# Altium project DuAn_HighVoltage_V3.PrjPcb (part 1 of 2)
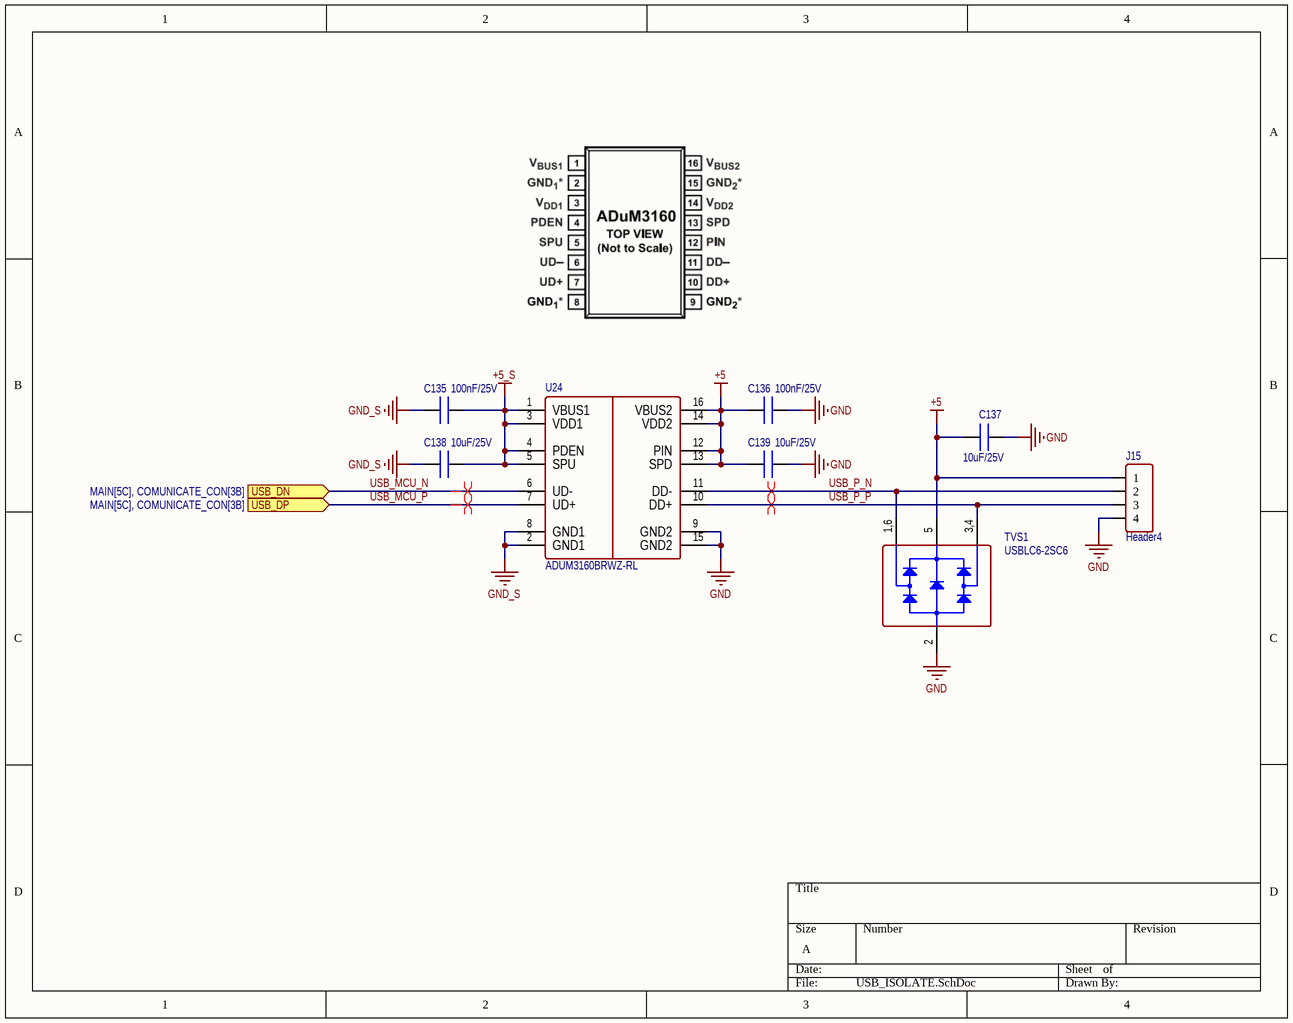
[diagram p0: USB_ISOLATE.SchDoc]
20 sheets, 387 parts. Net scope: hierarchical (ports join the sheet entries above them; power ports are global).
Board file: PCB1.PcbDoc
Sheets:
  USB_ISOLATE.SchDoc
  MAIN.SchDoc
    RS232 = RS232.SchDoc
    EXTERNAL_FAN1 = EXTERNAL_FAN.SchDoc
    EXTERNAL_FAN2 = EXTERNAL_FAN.SchDoc
    FLYBACK_300V = FLYBACK.SchDoc
      TEMPERATURE_SENSOR = TEMPERATURE_SENSOR.SchDoc
    FLYBACK_50V = FLYBACK.SchDoc
      TEMPERATURE_SENSOR = TEMPERATURE_SENSOR.SchDoc
    U_CAPACITOR = CAPACITOR.SchDoc
    INPUT_PROTECTION = INPUT_PROTECTION.SchDoc
    SECONDARY_POWER = SECONDARY_POWER.SchDoc
    PRIMARY_POWER = PRIMARY_POWER.SchDoc
    U_ACCELEROMETER = ACCELEROMETER.SchDoc
    U_ANALOG = ANALOG.SchDoc
    U_OVP = OVP.SchDoc
    U_CAP_RELEASE = CAP_RELEASE.SchDoc
    U_XBEE = XBEE.SchDoc
    U_POWER_CON = POWER_CON.SchDoc
    U_COMUNICATE_CON = COMUNICATE_CON.SchDoc
    U_PERIPHERAL_CON = PERIPHERAL_CON.SchDoc
    U_CHARGER = CHARGER.SchDoc
      U_I2C_ISO = I2C_ISO.SchDoc

## Sheet USB_ISOLATE.SchDoc
size A; SheetNumber: 8; SheetTotal: 21

### Parts
C135  100nF/25V  [CN-SMD-0603]
C136  100nF/25V  [CN-SMD-0603]
C137  10uF/25V  [CN-SMD-0603]
C138  10uF/25V  [CN-SMD-0603]
C139  10uF/25V  [CN-SMD-0603]
J15  Header4  [XH2.54-4-DIP]
TVS1  USBLC6-2SC6  [SOT23-6]
U24  ADUM3160BRWZ-RL  [SO16L]

### Ports
USB_DN (in, see MAIN[5C], COMUNICATE_CON[3B]), USB_DP (in, see MAIN[5C], COMUNICATE_CON[3B])

### Nets
+5: C136.2 C137.2 C139.2 J15.1 TVS1.5 U24.12(PIN) U24.13(SPD) U24.14(VDD2) U24.16(VBUS2)
+5_S: C135.1 C138.1 U24.1(VBUS1) U24.3(VDD1) U24.4(PDEN) U24.5(SPU)
GND: C136.1 C137.1 C139.1 J15.4 TVS1.2 U24.9(GND2) U24.15(GND2)
GND_S: C135.2 C138.2 U24.2(GND1) U24.8(GND1)
USB_MCU_N: U24.6(UD-) ; port USB_DN
USB_MCU_P: U24.7(UD+) ; port USB_DP
USB_P_N: J15.2 TVS1.1,6(IO1) U24.11(DD-)
USB_P_P: J15.3 TVS1.3,4(IO2) U24.10(DD+)

### Layout directives
differential pair; differential pair class USB: USB_P_N, USB_P_P
differential pair: USB_MCU_N, USB_MCU_P

### Library data of the parts
C135 C136 = CN: CL10B104KA8NNNC; PN: CL10B104KA8NNNC
C137-C139 = CN: 0603W106M250XD; PN: 0603W106M250XD
J15 = Header4: Connector 4; Manufacturer: W¨¹rth Elektronik eiSos GmbH; partNo: 613002143121; ComponentLink1 Description: Manufacturer; ComponentLink2 Description: Datasheet; NoPins: 02; Created Date: 29 March 2013; ComponentLink1URL: http://www.we-online.com; ComponentLink2URL: http://katalog.we-online.de/em/datasheet/6130xx143121.pdf; Created by: Karrer Zheng
TVS1 = USBLC6-2: PN: USBLC6-2SC6
U24 = ADUM3160: Full/Low Speed 2.5 kV USB Digital Isolator; PN: ADUM3160BRWZ-RL

## Sheet MAIN.SchDoc
size C; SheetNumber: 2; SheetTotal: 21
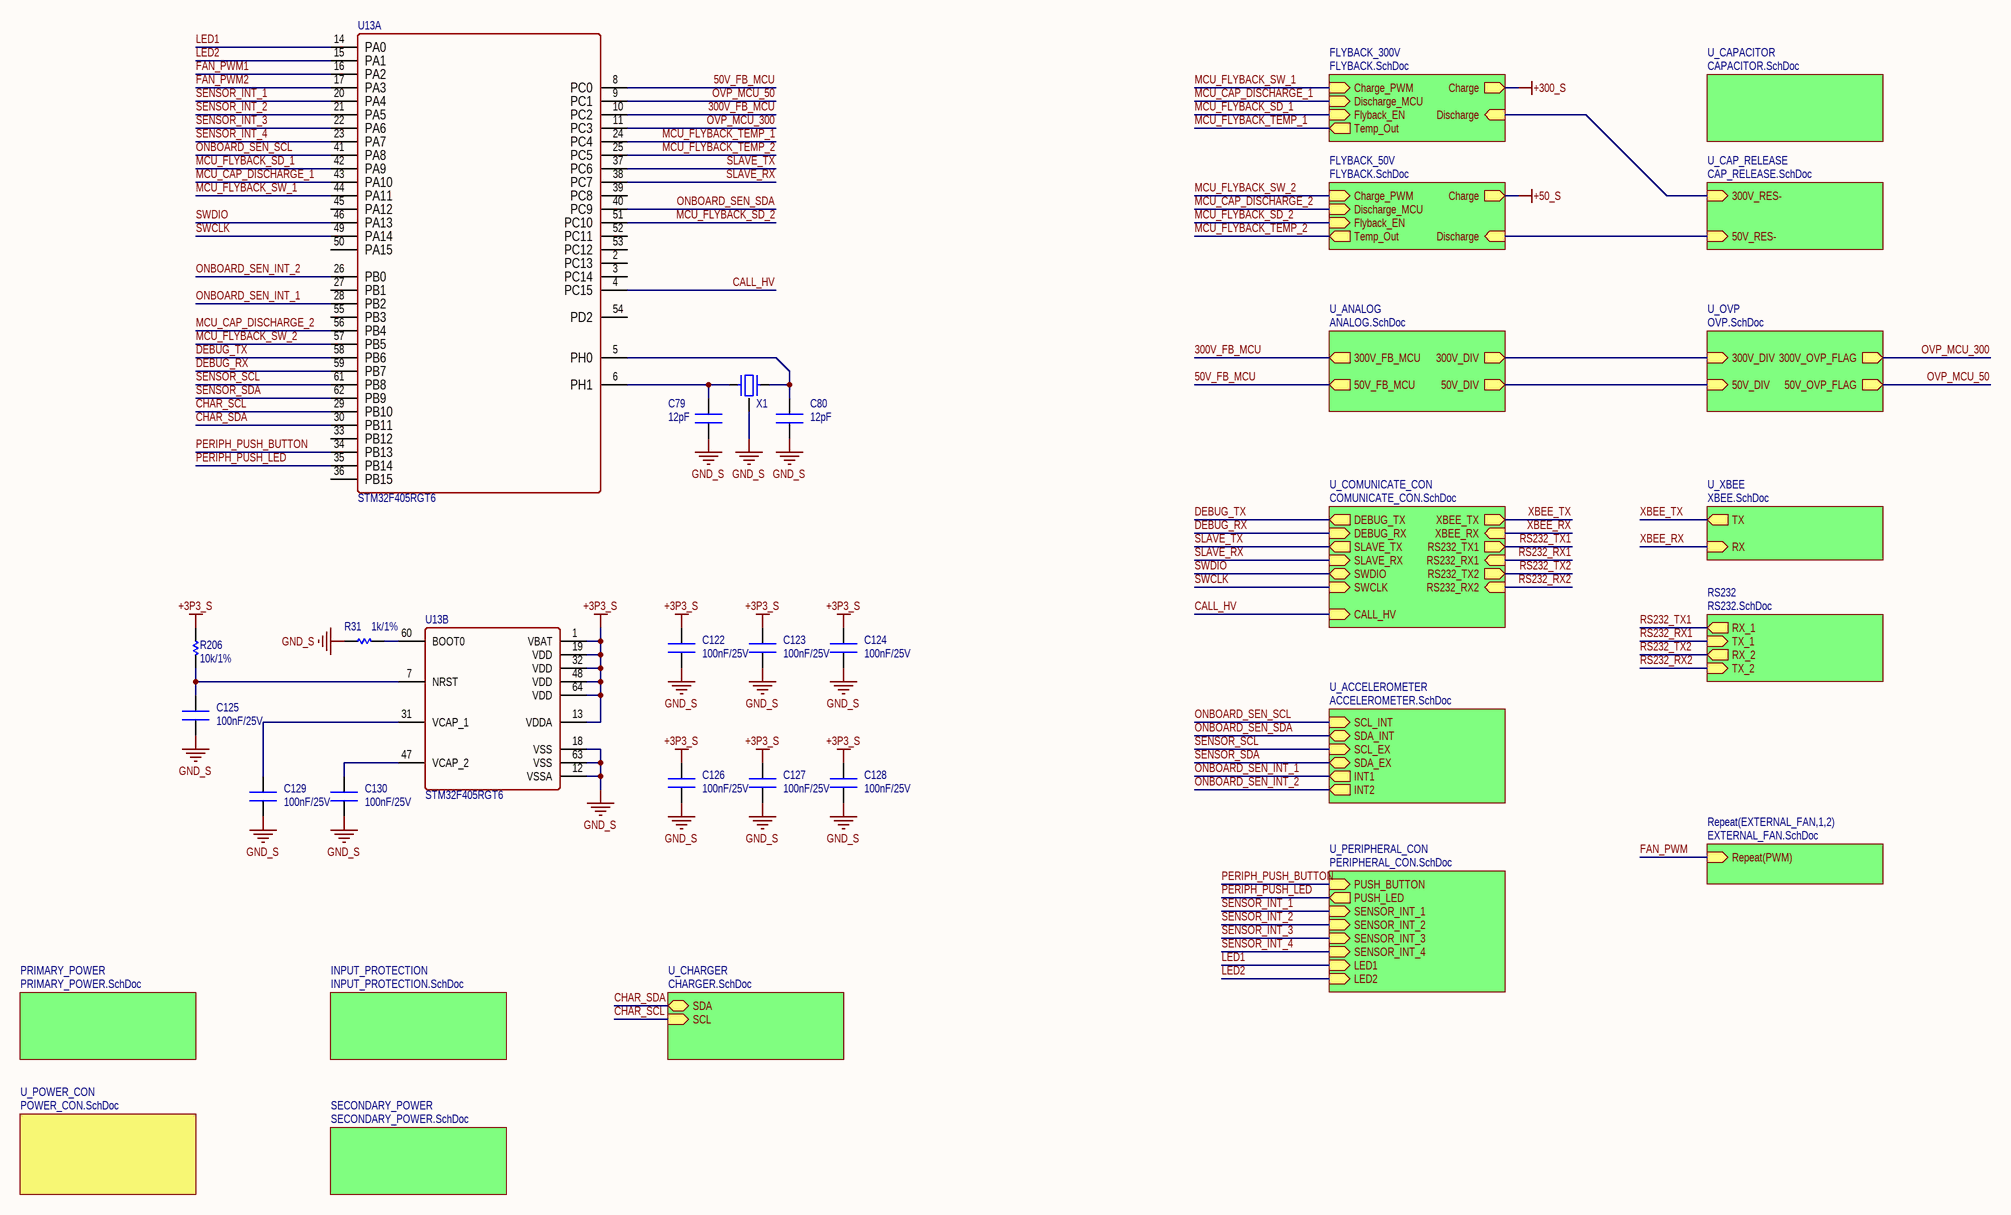
[diagram p1: MAIN.SchDoc]

### Parts
C79  12pF  [CN-SMD-0603]
C80  12pF  [CN-SMD-0603]
C122  100nF/25V  [CN-SMD-0603]
C123  100nF/25V  [CN-SMD-0603]
C124  100nF/25V  [CN-SMD-0603]
C125  100nF/25V  [CN-SMD-0603]
C126  100nF/25V  [CN-SMD-0603]
C127  100nF/25V  [CN-SMD-0603]
C128  100nF/25V  [CN-SMD-0603]
C129  100nF/25V  [CN-SMD-0603]
C130  100nF/25V  [CN-SMD-0603]
R31  1k/1%  [RES-SMD-0603]
R206  10k/1%  [RES-SMD-0603]
U13  STM32F405RGT6  [LQFP64]  (parts A,B of 2)
X1  ECS-80-8-33Q-ADS  [XT4-16.000MHz-4_V]  (value not drawn)

### Sub-sheets
FLYBACK_50V = FLYBACK.SchDoc: Discharge (in), Charge (out), Charge_PWM (in), Discharge_MCU (in), Flyback_EN (in), Temp_Out (out)
FLYBACK_300V = FLYBACK.SchDoc: Discharge (in), Charge (out), Charge_PWM (in), Discharge_MCU (in), Flyback_EN (in), Temp_Out (out)
INPUT_PROTECTION = INPUT_PROTECTION.SchDoc: no entries
PRIMARY_POWER = PRIMARY_POWER.SchDoc: no entries
Repeat(EXTERNAL_FAN,1,2) = EXTERNAL_FAN.SchDoc: Repeat(PWM) (in)
RS232 = RS232.SchDoc: RX_1 (out), TX_1 (in), RX_2 (out), TX_2 (in)
SECONDARY_POWER = SECONDARY_POWER.SchDoc: no entries
U_ACCELEROMETER = ACCELEROMETER.SchDoc: SCL_INT (in), SDA_INT (bidir), INT1 (out), INT2 (out), SCL_EX (in), SDA_EX (bidir)
U_ANALOG = ANALOG.SchDoc: 300V_FB_MCU (out), 50V_FB_MCU (out), 50V_DIV (out), 300V_DIV (out)
U_CAP_RELEASE = CAP_RELEASE.SchDoc: 300V_RES- (in), 50V_RES- (in)
U_CAPACITOR = CAPACITOR.SchDoc: no entries
U_CHARGER = CHARGER.SchDoc: SDA (bidir), SCL (in)
U_COMUNICATE_CON = COMUNICATE_CON.SchDoc: XBEE_TX (out), XBEE_RX (in), RS232_TX1 (out), RS232_RX1 (in), SLAVE_TX (out), SWDIO (bidir), SWCLK (in), DEBUG_TX (out), DEBUG_RX (in), RS232_TX2 (out), RS232_RX2 (in), SLAVE_RX (in), CALL_HV (in)
U_OVP = OVP.SchDoc: 300V_OVP_FLAG (out), 300V_DIV (in), 50V_OVP_FLAG (out), 50V_DIV (in)
U_PERIPHERAL_CON = PERIPHERAL_CON.SchDoc: PUSH_BUTTON (in), PUSH_LED (out), SENSOR_INT_1 (in), SENSOR_INT_2 (in), SENSOR_INT_3 (in), SENSOR_INT_4 (in), LED1 (in), LED2 (in)
U_POWER_CON = POWER_CON.SchDoc: no entries
U_XBEE = XBEE.SchDoc: TX (out), RX (in)

### Nets
+3P3_S: C122.1 C123.1 C124.1 C126.1 C127.1 C128.1 R206.2 U13.1(VBAT) U13.13(VDDA) U13.19(VDD) U13.32(VDD) U13.48(VDD) U13.64(VDD)
GND_S: C79.1 C80.1 C122.2 C123.2 C124.2 C125.2 C126.2 C127.2 C128.2 C129.2 C130.2 R31.2 U13.12(VSSA) U13.18(VSS) U13.63(VSS) X1.2,4(GND)
50V_FB_MCU: U13.8(PC0) ; sheet U_ANALOG/50V_FB_MCU
300V_FB_MCU: U13.10(PC2) ; sheet U_ANALOG/300V_FB_MCU
CALL_HV: U13.4(PC15) ; sheet U_COMUNICATE_CON/CALL_HV
CHAR_SCL: U13.29(PB10) ; sheet U_CHARGER/SCL
CHAR_SDA: U13.30(PB11) ; sheet U_CHARGER/SDA
DEBUG_RX: U13.59(PB7) ; sheet U_COMUNICATE_CON/DEBUG_RX
DEBUG_TX: U13.58(PB6) ; sheet U_COMUNICATE_CON/DEBUG_TX
FAN_PWM: sheet Repeat(EXTERNAL_FAN,1,2)/Repeat(PWM)
FAN_PWM1: U13.16(PA2)
FAN_PWM2: U13.17(PA3)
LED1: U13.14(PA0) ; sheet U_PERIPHERAL_CON/LED1
LED2: U13.15(PA1) ; sheet U_PERIPHERAL_CON/LED2
MCU_CAP_DISCHARGE_1: U13.43(PA10) ; sheet FLYBACK_300V/Discharge_MCU
MCU_CAP_DISCHARGE_2: U13.56(PB4) ; sheet FLYBACK_50V/Discharge_MCU
MCU_FLYBACK_SD_1: U13.42(PA9) ; sheet FLYBACK_300V/Flyback_EN
MCU_FLYBACK_SD_2: U13.51(PC10) ; sheet FLYBACK_50V/Flyback_EN
MCU_FLYBACK_SW_1: U13.44(PA11) ; sheet FLYBACK_300V/Charge_PWM
MCU_FLYBACK_SW_2: U13.57(PB5) ; sheet FLYBACK_50V/Charge_PWM
MCU_FLYBACK_TEMP_1: U13.24(PC4) ; sheet FLYBACK_300V/Temp_Out
MCU_FLYBACK_TEMP_2: U13.25(PC5) ; sheet FLYBACK_50V/Temp_Out
ONBOARD_SEN_INT_1: U13.28(PB2) ; sheet U_ACCELEROMETER/INT1
ONBOARD_SEN_INT_2: U13.26(PB0) ; sheet U_ACCELEROMETER/INT2
ONBOARD_SEN_SCL: U13.41(PA8) ; sheet U_ACCELEROMETER/SCL_INT
ONBOARD_SEN_SDA: U13.40(PC9) ; sheet U_ACCELEROMETER/SDA_INT
OVP_MCU_50: U13.9(PC1) ; sheet U_OVP/50V_OVP_FLAG
OVP_MCU_300: U13.11(PC3) ; sheet U_OVP/300V_OVP_FLAG
PERIPH_PUSH_BUTTON: U13.34(PB13) ; sheet U_PERIPHERAL_CON/PUSH_BUTTON
PERIPH_PUSH_LED: U13.35(PB14) ; sheet U_PERIPHERAL_CON/PUSH_LED
RS232_RX1: sheet RS232/TX_1, sheet U_COMUNICATE_CON/RS232_RX1
RS232_RX2: sheet RS232/TX_2, sheet U_COMUNICATE_CON/RS232_RX2
RS232_TX1: sheet RS232/RX_1, sheet U_COMUNICATE_CON/RS232_TX1
RS232_TX2: sheet RS232/RX_2, sheet U_COMUNICATE_CON/RS232_TX2
SENSOR_INT_1: U13.20(PA4) ; sheet U_PERIPHERAL_CON/SENSOR_INT_1
SENSOR_INT_2: U13.21(PA5) ; sheet U_PERIPHERAL_CON/SENSOR_INT_2
SENSOR_INT_3: U13.22(PA6) ; sheet U_PERIPHERAL_CON/SENSOR_INT_3
SENSOR_INT_4: U13.23(PA7) ; sheet U_PERIPHERAL_CON/SENSOR_INT_4
SENSOR_SCL: U13.61(PB8) ; sheet U_ACCELEROMETER/SCL_EX
SENSOR_SDA: U13.62(PB9) ; sheet U_ACCELEROMETER/SDA_EX
SLAVE_RX: U13.38(PC7) ; sheet U_COMUNICATE_CON/SLAVE_RX
SLAVE_TX: U13.37(PC6) ; sheet U_COMUNICATE_CON/SLAVE_TX
SWCLK: U13.49(PA14) ; sheet U_COMUNICATE_CON/SWCLK
SWDIO: U13.46(PA13) ; sheet U_COMUNICATE_CON/SWDIO
XBEE_RX: sheet U_XBEE/RX, sheet U_COMUNICATE_CON/XBEE_RX
XBEE_TX: sheet U_XBEE/TX, sheet U_COMUNICATE_CON/XBEE_TX
NetC79_2: C79.2 U13.6(PH1) X1.3
NetC80_2: C80.2 U13.5(PH0) X1.1
NetC125_1: C125.1 R206.1 U13.7(NRST)
NetC129_1: C129.1 U13.31(VCAP_1)
NetC130_1: C130.1 U13.47(VCAP_2)
NetQ2A_2: sheet FLYBACK_300V/Discharge, sheet U_CAP_RELEASE/300V_RES-
NetQ2B_2: sheet FLYBACK_50V/Discharge, sheet U_CAP_RELEASE/50V_RES-
NetR31_1: R31.1 U13.60(BOOT0)
NetR53_2: sheet U_ANALOG/300V_DIV, sheet U_OVP/300V_DIV
NetR57_2: sheet U_ANALOG/50V_DIV, sheet U_OVP/50V_DIV

Not connected (* = marked no-connect by the designer): U13 2(PC13) 3(PC14) 27(PB1) 33(PB12) 36(PB15) 39(PC8) 45(PA12) 50(PA15) 52(PC11) 53(PC12) 54(PD2) 55(PB3)

### Library data of the parts
C79 C80 = CN: CL10C120JB81PNC; PN: CL10C120JB81PNC
C122-C130 = CN: CL10B104KA8NNNC; PN: CL10B104KA8NNNC
R31 = Res-SMD: ERJ-3EKF1001V; Manufacturer: Generic Components; Class: Passive; PN: ERJ-3EKF1001V; Publisher: Altium Hobart Technology Centre
R206 = Res-SMD: ERJ-3EKF1002V; Manufacturer: Generic Components; Class: Passive; PN: ERJ-3EKF1002V; Publisher: Altium Hobart Technology Centre
U13 = STM32F405RGT6: High-performance foundation line, ARM Cortex-M4 core with DSP and FPU, 1 Mbyte Flash, 168 MHz CPU, ART Accelerator; PN: STM32F405RGT6
X1 = XT4: PN: ECS-80-8-33Q-ADS

## Sheet RS232.SchDoc
size A; SheetNumber: 10; SheetTotal: 21
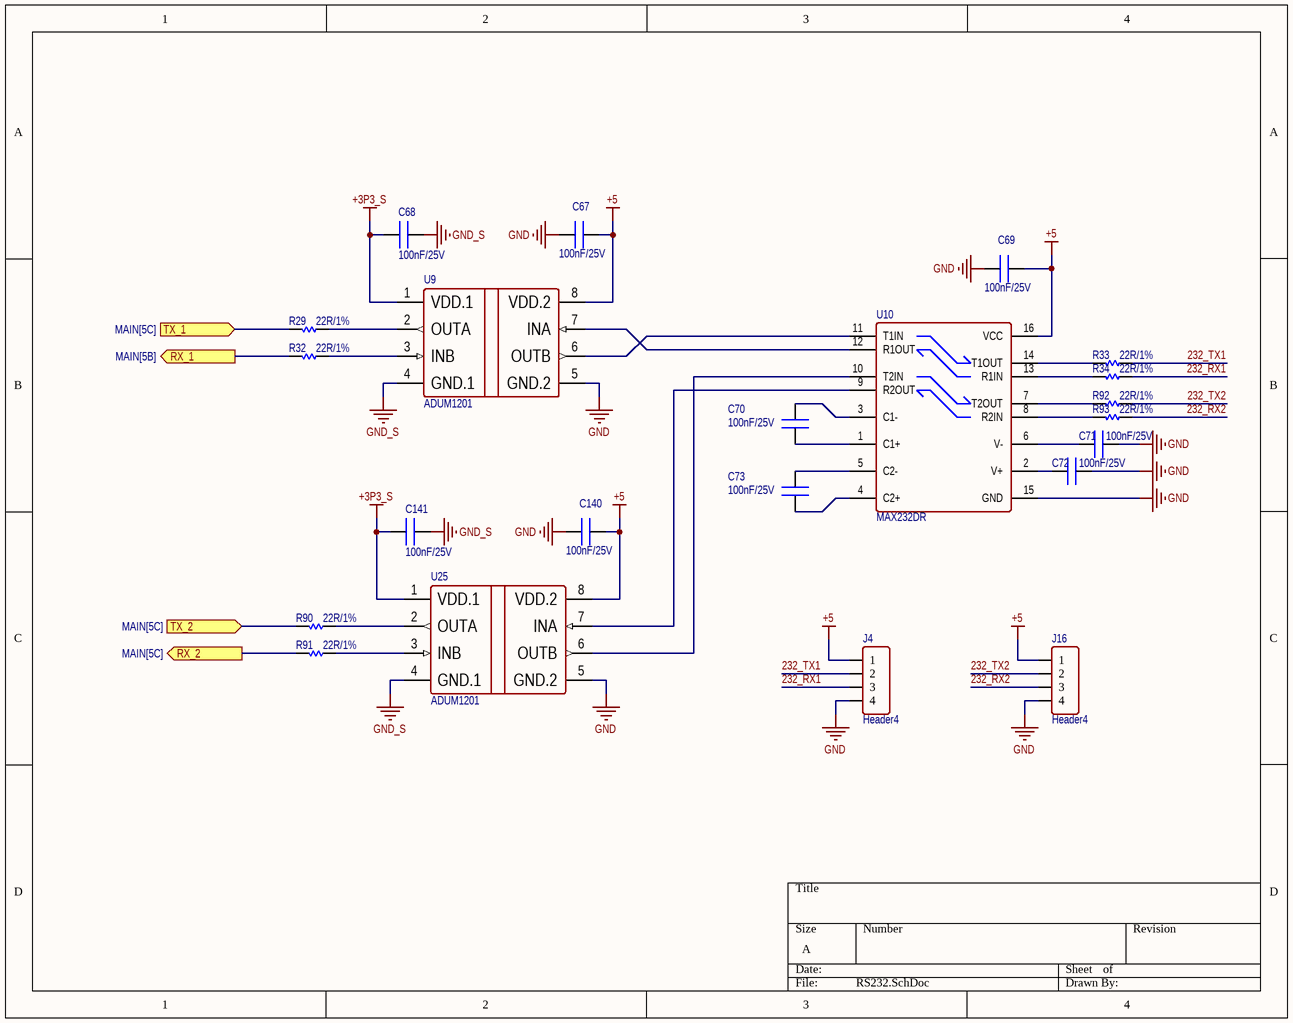
[diagram p2: RS232.SchDoc]

### Parts
C67  100nF/25V  [CN-SMD-0603]
C68  100nF/25V  [CN-SMD-0603]
C69  100nF/25V  [CN-SMD-0603]
C70  100nF/25V  [CN-SMD-0603]
C71  100nF/25V  [CN-SMD-0603]
C72  100nF/25V  [CN-SMD-0603]
C73  100nF/25V  [CN-SMD-0603]
C140  100nF/25V  [CN-SMD-0603]
C141  100nF/25V  [CN-SMD-0603]
J4  Header4  [XH2.54-4-DIP]
J16  Header4  [XH2.54-4-DIP]
R29  22R/1%  [RES-SMD-0603]
R32  22R/1%  [RES-SMD-0603]
R33  22R/1%  [RES-SMD-0603]
R34  22R/1%  [RES-SMD-0603]
R90  22R/1%  [RES-SMD-0603]
R91  22R/1%  [RES-SMD-0603]
R92  22R/1%  [RES-SMD-0603]
R93  22R/1%  [RES-SMD-0603]
U9  ADUM1201  [SO8]
U10  MAX232DR  [SO16]
U25  ADUM1201  [SO8]

### Ports
RX_1 (out, see MAIN[5B]), RX_2 (out, see MAIN[5C]), TX_1 (in, see MAIN[5C]), TX_2 (in, see MAIN[5C])

### Nets
+3P3_S: C68.2 C141.2 U9.1(VDD.1) U25.1(VDD.1)
+5: C67.1 C69.1 C140.1 J4.1 J16.1 U9.8(VDD.2) U10.16(VCC) U25.8(VDD.2)
GND: C67.2 C69.2 C71.1 C72.1 C140.2 J4.4 J16.4 U9.5(GND.2) U10.15(GND) U25.5(GND.2)
GND_S: C68.1 C141.1 U9.4(GND.1) U25.4(GND.1)
232_RX1: J4.3 R34.1
232_RX2: J16.3 R93.1
232_TX1: J4.2 R33.1
232_TX2: J16.2 R92.1
RS232_RX1: R29.2 ; port TX_1
RS232_RX2: R90.2 ; port TX_2
RS232_TX1: R32.2 ; port RX_1
RS232_TX2: R91.2 ; port RX_2
NetC70_1: C70.1 U10.1(C1+)
NetC70_2: C70.2 U10.3(C1-)
NetC71_2: C71.2 U10.6(V-)
NetC72_2: C72.2 U10.2(V+)
NetC73_1: C73.1 U10.4(C2+)
NetC73_2: C73.2 U10.5(C2-)
NetR29_1: R29.1 U9.2(OUTA)
NetR32_1: R32.1 U9.3(INB)
NetR33_2: R33.2 U10.14(T1OUT)
NetR34_2: R34.2 U10.13(R1IN)
NetR90_1: R90.1 U25.2(OUTA)
NetR91_1: R91.1 U25.3(INB)
NetR92_2: R92.2 U10.7(T2OUT)
NetR93_2: R93.2 U10.8(R2IN)
NetU9_6: U9.6(OUTB) U10.11(T1IN)
NetU9_7: U9.7(INA) U10.12(R1OUT)
NetU10_9: U10.9(R2OUT) U25.7(INA)
NetU10_10: U10.10(T2IN) U25.6(OUTB)

### Library data of the parts
C67-C73 C140 C141 = CN: CL10B104KA8NNNC; PN: CL10B104KA8NNNC
J4 J16 = Header4: as J15 on sheet USB_ISOLATE; Created Date: 29 March 2013; ComponentLink1URL: http://www.we-online.com; ComponentLink2URL: http://katalog.we-online.de/em/datasheet/6130xx143121.pdf; Created by: Karrer Zheng
R29 R32-R34 R90-R93 = Res-SMD: ERJ-3EKF22R0V; PN: ERJ-3EKF22R0V
U9 U25 = ADUM1201: Dual-Channel Digital Isolators; PN: ADUM1201CRZ-RL7
U10 = MAX3232: PN: MAX232DR

## Sheet EXTERNAL_FAN.SchDoc
size A; SheetNumber: 9; SheetTotal: 21
Used 2 times, as channels EXTERNAL_FAN1, EXTERNAL_FAN2. Parts and nets are listed once, with the designators drawn on the sheet.
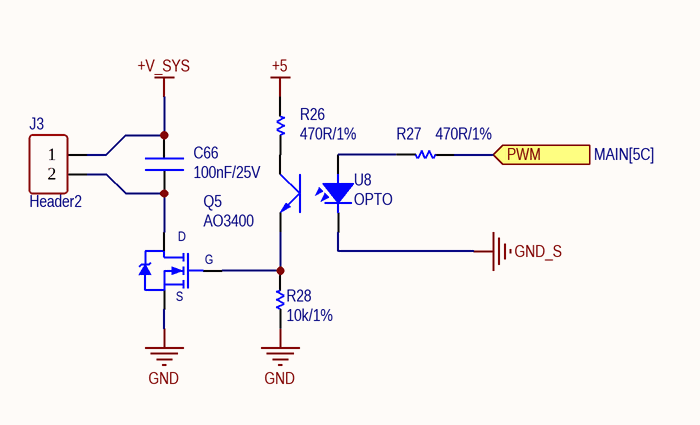
[diagram p3: EXTERNAL_FAN.SchDoc]

### Parts
C66  100nF/25V  [CN-SMD-0603]
J3  Header2  [XH2.54-2-DIP]
Q5  AO3400  [SOT23-123]
R26  470R/1%  [RES-SMD-0603]
R27  470R/1%  [RES-SMD-0603]
R28  10k/1%  [RES-SMD-0603]
U8  OPTO  [EL3H7]

### Ports
PWM (in, see MAIN[5C])

### Nets
+5: R26.1
+V_SYS: C66.1 J3.1
GND: Q5.3(S) R28.1
GND_S: U8.K
PWM: R27.1 ; port PWM
NetC66_2: C66.2 J3.2 Q5.2(D)
NetQ5_1: Q5.1(G) R28.2 U8.E
NetR26_2: R26.2 U8.C
NetR27_2: R27.2 U8.A

### Channels
EXTERNAL_FAN1: designators end in A; ports PWM=FAN_PWM1
EXTERNAL_FAN2: designators end in B; ports PWM=FAN_PWM2

### Library data of the parts
C66 = CN: CL10B104KA8NNNC; PN: CL10B104KA8NNNC
J3 = Header2: Connector 2; Manufacturer: W¨¹rth Elektronik eiSos GmbH; partNo: 613002143121; ComponentLink1 Description: Manufacturer; ComponentLink2 Description: Datasheet; NoPins: 02; Created Date: 29 March 2013; ComponentLink1URL: http://www.we-online.com; ComponentLink2URL: http://katalog.we-online.de/em/datasheet/6130xx143121.pdf; Created by: Karrer Zheng
Q5 = AO3400: N-MOS 30V 5.8A; PN: AO3400
R26 R27 = Res-SMD: ERJ-1GJF4700C; Manufacturer: Generic Components; Class: Passive; PN: ERJ-1GJF4700C; Publisher: Altium Hobart Technology Centre
R28 = Res-SMD: as R206 on sheet MAIN; PN: ERJ-3EKF1002V; Publisher: Altium Hobart Technology Centre
U8 = OPTO: EL3H7(B)(TA)-VG; PN: EL3H7(B)(TA)-VG

## Sheet FLYBACK.SchDoc
size A; SheetNumber: 2; SheetTotal: 21
Used 2 times, as channels FLYBACK_300V, FLYBACK_50V. Parts and nets are listed once, with the designators drawn on the sheet.
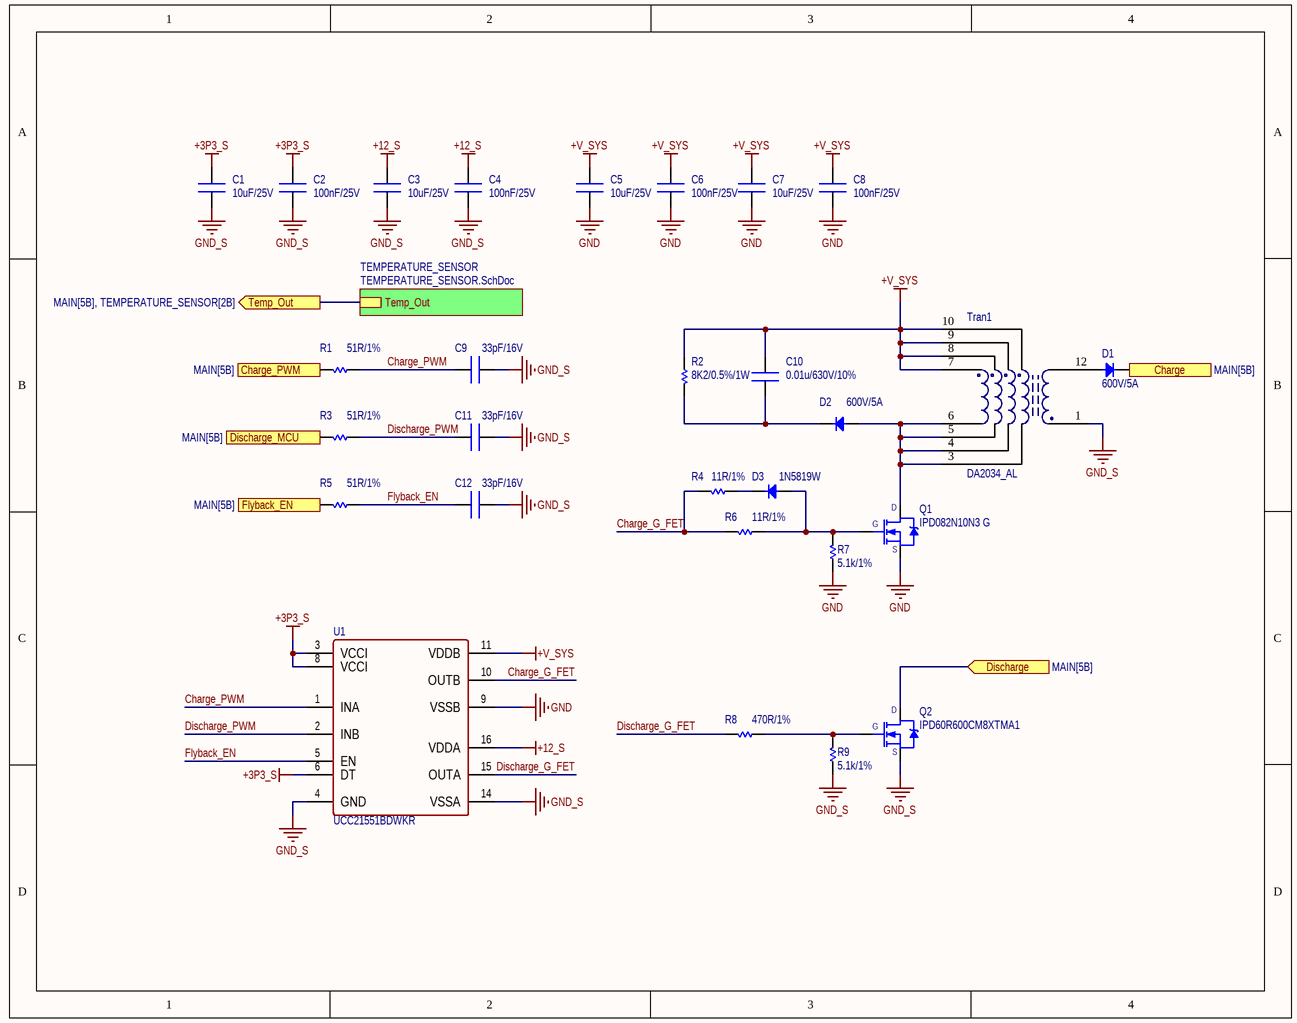
[diagram p4: FLYBACK.SchDoc]

### Parts
C1  10uF/25V  [CN-SMD-0603]
C2  100nF/25V  [CN-SMD-0603]
C3  10uF/25V  [CN-SMD-0603]
C4  100nF/25V  [CN-SMD-0603]
C5  10uF/25V  [CN-SMD-0603]
C6  100nF/25V  [CN-SMD-0603]
C7  10uF/25V  [CN-SMD-0603]
C8  100nF/25V  [CN-SMD-0603]
C9  33pF/16V  [CN-SMD-0603]
C10  0.01u/630V/10%  [CN-SMD-1206]
C11  33pF/16V  [CN-SMD-0603]
C12  33pF/16V  [CN-SMD-0603]
D1  600V/5A  [DIO-SMD-C]
D2  600V/5A  [DIO-SMD-C]
D3  1N5819W  [DIO-SMD-123]
Q1  IPD082N10N3 G  [TO252-123]
Q2  IPD60R600CM8XTMA1  [TO252-123]
R1  51R/1%  [RES-SMD-0603]
R2  8K2/0.5%/1W  [RES-SMD-1206]
R3  51R/1%  [RES-SMD-0603]
R4  11R/1%  [RES-SMD-1206]
R5  51R/1%  [RES-SMD-0603]
R6  11R/1%  [RES-SMD-1206]
R7  5.1k/1%  [RES-SMD-0603]
R8  470R/1%  [RES-SMD-0603]
R9  5.1k/1%  [RES-SMD-0603]
Tran1  DA2034_AL  [DA2034_AL]
U1  UCC21551BDWKR  [UCC21551BDWKR]

### Sub-sheets
TEMPERATURE_SENSOR = TEMPERATURE_SENSOR.SchDoc: Temp_Out

### Ports
Charge (out, see MAIN[5B]), Charge_PWM (in, see MAIN[5B]), Discharge (in, see MAIN[5B]), Discharge_MCU (in, see MAIN[5B]), Flyback_EN (in, see MAIN[5B]), Temp_Out (out, see MAIN[5B], TEMPERATURE_SENSOR[2B])

### Nets
+3P3_S: C1.2 C2.2 U1.3(VCCI) U1.6(DT) U1.8(VCCI)
+12_S: C3.2 C4.2 U1.16(VDDA)
+V_SYS: C5.2 C6.2 C7.2 C8.2 C10.2 R2.1 Tran1.7 Tran1.8 Tran1.9 Tran1.10 U1.11(VDDB)
GND: C5.1 C6.1 C7.1 C8.1 Q1.3(S) R7.1 U1.9(VSSB)
GND_S: C1.1 C2.1 C3.1 C4.1 C9.1 C11.1 C12.1 Q2.3(S) R9.1 Tran1.1 U1.4(GND) U1.14(VSSA)
Charge: D1.2(K) ; port Charge
Charge_G_FET: R4.2 R6.2 U1.10(OUTB)
Charge_PWM: C9.2 R1.1 U1.1(INA)
Charge_PWM: R1.2 ; port Charge_PWM  [a separate net that carries the same name]
Discharge: Q2.2(D) ; port Discharge
Discharge_G_FET: R8.2 U1.15(OUTA)
Discharge_MCU: R3.2 ; port Discharge_MCU
Discharge_PWM: C11.2 R3.1 U1.2(INB)
Flyback_EN: C12.2 R5.1 U1.5(EN)
Flyback_EN: R5.2 ; port Flyback_EN  [a separate net that carries the same name]
Temp_Out: port Temp_Out, sheet TEMPERATURE_SENSOR/Temp_Out
NetC10_1: C10.1 D2.2(K) R2.2
NetD1_1: D1.1(A) Tran1.12
NetD2_1: D2.1(A) Q1.2(D) Tran1.3 Tran1.4 Tran1.5 Tran1.6
NetD3_1: D3.1(A) Q1.1(G) R6.1 R7.2
NetD3_2: D3.2(K) R4.1
NetQ2_1: Q2.1(G) R8.1 R9.2

### Channels
FLYBACK_300V: designators end in A; ports Charge=+300_S Charge_PWM=MCU_FLYBACK_SW_1 Discharge=NetQ2A_2 Discharge_MCU=MCU_CAP_DISCHARGE_1 Flyback_EN=MCU_FLYBACK_SD_1 Temp_Out=MCU_FLYBACK_TEMP_1
FLYBACK_50V: designators end in B; ports Charge=+50_S Charge_PWM=MCU_FLYBACK_SW_2 Discharge=NetQ2B_2 Discharge_MCU=MCU_CAP_DISCHARGE_2 Flyback_EN=MCU_FLYBACK_SD_2 Temp_Out=MCU_FLYBACK_TEMP_2

### Library data of the parts
C1 C3 C5 C7 = CN: 0603W106M250XD; PN: 0603W106M250XD
C2 C4 C6 C8 = CN: CL10B104KA8NNNC; PN: CL10B104KA8NNNC
C9 C11 C12 = CN: C0603C330K4RAC7867; PN: C0603C330K4RAC7867
C10 = CN: CL31B103KHFNFNE; Value: 33pF; PN: CL31B103KHFNFNE
D1 D2 = Diode SMD: VS-5ECU06-M3/9AT; Code - JEDEC: DO-214-AB; Published: 8-Jun-2000; Revision: July-2002: Re-released for DXP Platform.; Publisher: Altium Limited; PN: VS-5ECU06-M3/9AT
D3 = Diode SMD: Default Diode; Code - JEDEC: DO-214-AB; Published: 8-Jun-2000; Revision: July-2002: Re-released for DXP Platform.; Publisher: Altium Limited; PN: 1N5819W
Q1 Q2 = FDD8870
  Q1: PN: IPD082N10N3 G
  Q2: PN: IPD60R600CM8XTMA1
R1 R3 R5 = Res-SMD: ERJ-3EKF51R0V; Manufacturer: Generic Components; Class: Passive; PN: ERJ-3EKF51R0V; Publisher: Altium Hobart Technology Centre
R2 = Res-SMD: HRG3216P-8201-D-T1; Manufacturer: Generic Components; Class: Passive; PN: HRG3216P-8201-D-T1; Publisher: Altium Hobart Technology Centre
R4 R6 = Res-SMD: CRCW120611R0FKEAHP; Manufacturer: Generic Components; Class: Passive; PN: CRCW120611R0FKEAHP; Publisher: Altium Hobart Technology Centre
R7 R9 = Res-SMD: ERJ-3EKF5101V; PN: ERJ-3EKF5101V
R8 = Res-SMD: as R26 on sheet EXTERNAL_FAN; PN: ERJ-1GJF4700C; Publisher: Altium Hobart Technology Centre
Tran1 = DA2034_AL: PN: DA2034_AL
U1 = UCC21551BDWKR: PN: UCC21551BDWKR

## Sheet TEMPERATURE_SENSOR.SchDoc
size A; SheetNumber: 3; SheetTotal: 21
Used 2 times, as channels FLYBACK_300V/TEMPERATURE_SENSOR, FLYBACK_50V/TEMPERATURE_SENSOR. Parts and nets are listed once, with the designators drawn on the sheet.
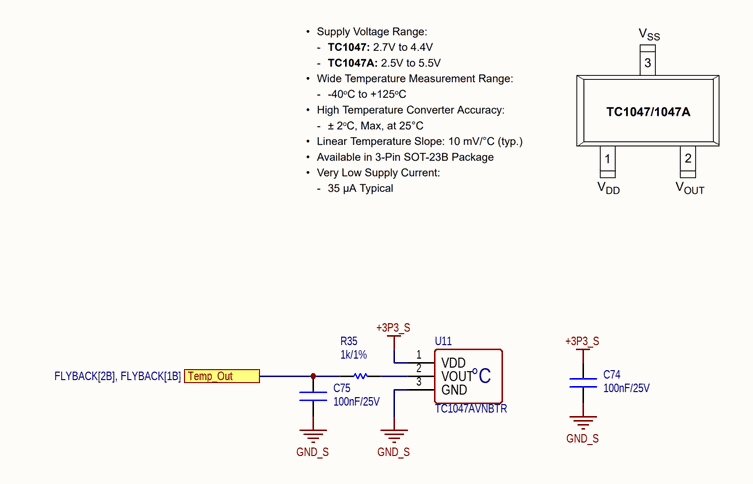
[diagram p5: TEMPERATURE_SENSOR.SchDoc]

### Parts
C74  100nF/25V  [CN-SMD-0603]
C75  100nF/25V  [CN-SMD-0603]
R35  1k/1%  [RES-SMD-0603]
U11  TC1047AVNBTR  [SOT23-132]

### Ports
Temp_Out (see FLYBACK[2B], FLYBACK[1B])

### Nets
+3P3_S: C74.2 U11.1(VDD)
GND_S: C74.1 C75.1 U11.3(GND)
Temp_Out: C75.2 R35.1 ; port Temp_Out
NetR35_2: R35.2 U11.2(VOUT)

### Channels
FLYBACK_300V/TEMPERATURE_SENSOR: designators end in A; ports Temp_Out=MCU_FLYBACK_TEMP_1
FLYBACK_50V/TEMPERATURE_SENSOR: designators end in B; ports Temp_Out=MCU_FLYBACK_TEMP_2

### Notes on the sheet
- (in symbol TC1047AVNBTR) °C

### Library data of the parts
C74 C75 = CN: CL10B104KA8NNNC; PN: CL10B104KA8NNNC
R35 = Res-SMD: as R31 on sheet MAIN; PN: ERJ-3EKF1001V; Publisher: Altium Hobart Technology Centre
U11 = TC1047AVNBTR: Precision Temperature-to-Voltage Converter; PN: TC1047AVNBTR

## Sheet CAPACITOR.SchDoc
size A; SheetNumber: 4; SheetTotal: 21
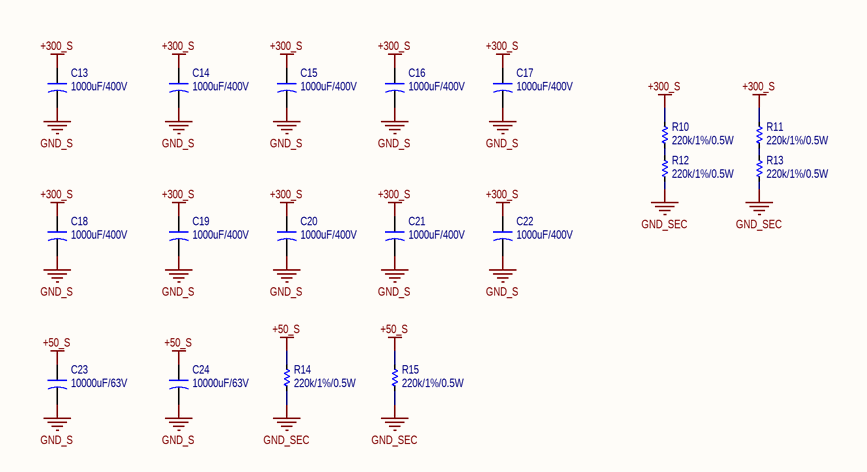
[diagram p6: CAPACITOR.SchDoc]

### Parts
C13  1000uF/400V  [CA-ALU-35x50]
C14  1000uF/400V  [CA-ALU-35x50]
C15  1000uF/400V  [CA-ALU-35x50]
C16  1000uF/400V  [CA-ALU-35x50]
C17  1000uF/400V  [CA-ALU-35x50]
C18  1000uF/400V  [CA-ALU-35x50]
C19  1000uF/400V  [CA-ALU-35x50]
C20  1000uF/400V  [CA-ALU-35x50]
C21  1000uF/400V  [CA-ALU-35x50]
C22  1000uF/400V  [CA-ALU-35x50]
C23  10000uF/63V  [CA-ALU-35x50]
C24  10000uF/63V  [CA-ALU-35x50]
R10  220k/1%/0.5W  [RES-SMD-2010]
R11  220k/1%/0.5W  [RES-SMD-2010]
R12  220k/1%/0.5W  [RES-SMD-2010]
R13  220k/1%/0.5W  [RES-SMD-2010]
R14  220k/1%/0.5W  [RES-SMD-2010]
R15  220k/1%/0.5W  [RES-SMD-2010]

### Nets
+50_S: C23.1 C24.1 R14.1 R15.1
+300_S: C13.1 C14.1 C15.1 C16.1 C17.1 C18.1 C19.1 C20.1 C21.1 C22.1 R10.1 R11.1
GND_S: C13.2 C14.2 C15.2 C16.2 C17.2 C18.2 C19.2 C20.2 C21.2 C22.2 C23.2 C24.2
GND_SEC: R12.2 R13.2 R14.2 R15.2
NetR10_2: R10.2 R12.1
NetR11_2: R11.2 R13.1

### Library data of the parts
C13-C24 = CN-ALU-DIP: NO PN; Value: 104; LatestRevisionDate: 17-Jul-2002; LatestRevisionNote: Re-released for DXP Platform.; PackageReference: C1206; Publisher: Altium Limited
R10-R15 = Res-SMD: CHV2010-FX-2203ELF; Manufacturer: Generic Components; Class: Passive; PN: CHV2010-FX-2203ELF; Publisher: Altium Hobart Technology Centre

## Sheet INPUT_PROTECTION.SchDoc
size A; SheetNumber: 5; SheetTotal: 21
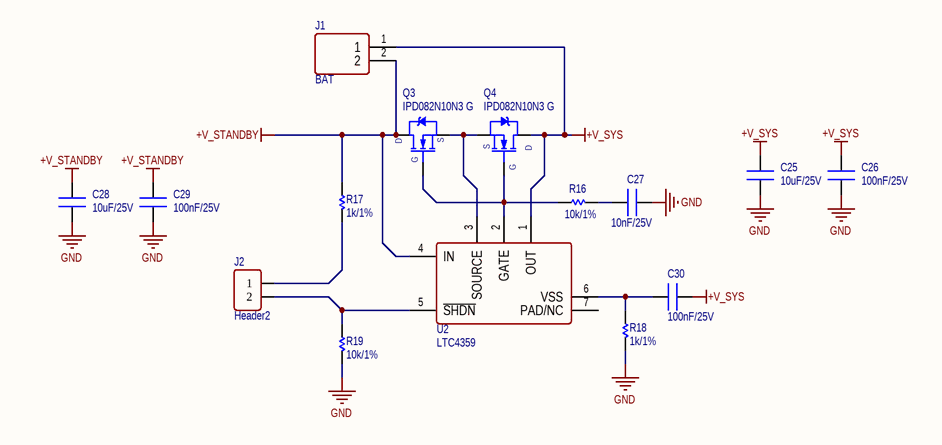
[diagram p7: INPUT_PROTECTION.SchDoc]

### Parts
C25  10uF/25V  [CN-SMD-0603]
C26  100nF/25V  [CN-SMD-0603]
C27  10nF/25V  [CN-SMD-0603]
C28  10uF/25V  [CN-SMD-0603]
C29  100nF/25V  [CN-SMD-0603]
C30  100nF/25V  [CN-SMD-0603]
J1  BAT  [S2P-VH(LF)(SN)]
J2  Header2  [XH2.54-2-DIP]
Q3  IPD082N10N3 G  [TO252-123]
Q4  IPD082N10N3 G  [TO252-123]
R16  10k/1%  [RES-SMD-0603]
R17  1k/1%  [RES-SMD-0603]
R18  1k/1%  [RES-SMD-0603]
R19  10k/1%  [RES-SMD-0603]
U2  LTC4359  [VSSOP8]

### Nets
+V_STANDBY: C28.2 C29.2 J1.2 Q3.2(D) R17.1 U2.4(IN)
+V_SYS: C25.2 C26.2 C30.2 J1.1 Q4.2(D) U2.1(OUT)
GND: C25.1 C26.1 C27.1 C28.1 C29.1 R18.2 R19.2
NetC27_2: C27.2 R16.2
NetC30_1: C30.1 R18.1 U2.6(VSS)
NetJ2_1: J2.1 R17.2
NetJ2_2: J2.2 R19.1 U2.5(~{SHDN})
NetQ3_1: Q3.1(G) Q4.1(G) R16.1 U2.2(GATE)
NetQ3_3: Q3.3(S) Q4.3(S) U2.3(SOURCE)

Not connected (* = marked no-connect by the designer): U2 7(PAD/NC)

### Library data of the parts
C25 C28 = CN: 0603W106M250XD; PN: 0603W106M250XD
C26 C29 C30 = CN: CL10B104KA8NNNC; PN: CL10B104KA8NNNC
C27 = CN: CL10B103KB8NNNC; PN: CL10B103KB8NNNC
J1 = KF2: S2P-VH; ComponentLink1 Description: Manufacturer; ComponentLink2 Description: Datasheet; PN: S2P-VH; ComponentLink1URL: http://www.we-online.com; ComponentLink2URL: http://katalog.we-online.de/em/datasheet/6911031100xx.pdf
J2 = Header2: as J3 on sheet EXTERNAL_FAN; Created Date: 29 March 2013; ComponentLink1URL: http://www.we-online.com; ComponentLink2URL: http://katalog.we-online.de/em/datasheet/6130xx143121.pdf; Created by: Karrer Zheng
Q3 Q4 = FDD8870: PN: IPD082N10N3 G
R16 R19 = Res-SMD: as R206 on sheet MAIN; PN: ERJ-3EKF1002V; Publisher: Altium Hobart Technology Centre
R17 R18 = Res-SMD: as R31 on sheet MAIN; PN: ERJ-3EKF1001V; Publisher: Altium Hobart Technology Centre
U2 = LTC4359: Ideal Diode Controller with Reverse Input Protection; pin to pad: 1>8 2>1 3>2; PN: LTC4359CMS8#TRPBF

## Sheet SECONDARY_POWER.SchDoc
size A; SheetNumber: 7; SheetTotal: 21
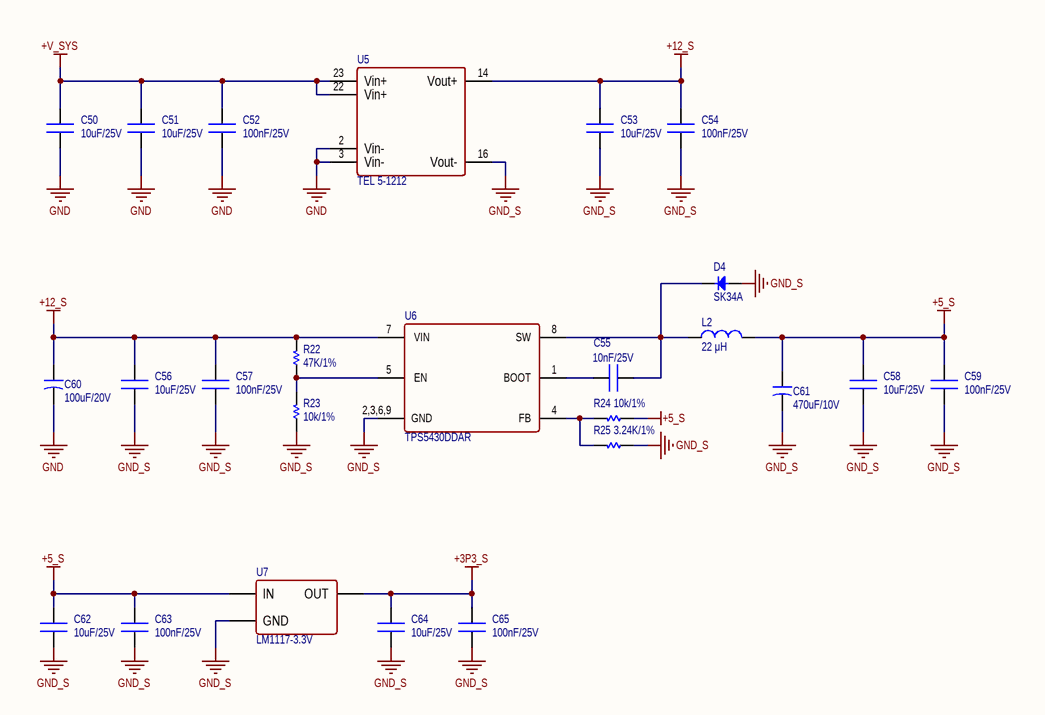
[diagram p8: SECONDARY_POWER.SchDoc]

### Parts
C50  10uF/25V  [CN-SMD-0603]
C51  10uF/25V  [CN-SMD-0603]
C52  100nF/25V  [CN-SMD-0603]
C53  10uF/25V  [CN-SMD-0603]
C54  100nF/25V  [CN-SMD-0603]
C55  10nF/25V  [CN-SMD-0603]
C56  10uF/25V  [CN-SMD-0603]
C57  100nF/25V  [CN-SMD-0603]
C58  10uF/25V  [CN-SMD-0603]
C59  100nF/25V  [CN-SMD-0603]
C60  100uF/20V  [Tantalum 2917]
C61  470uF/10V  [Tantalum 2917]
C62  10uF/25V  [CN-SMD-0603]
C63  100nF/25V  [CN-SMD-0603]
C64  10uF/25V  [CN-SMD-0603]
C65  100nF/25V  [CN-SMD-0603]
D4  SK34A  [DIO-SMD-A]
L2  22 μH  [PSM6050]
R22  47K/1%  [RES-SMD-0603]
R23  10k/1%  [RES-SMD-0603]
R24  10k/1%  [RES-SMD-0603]
R25  3.24K/1%  [RES-SMD-0603]
U5  TEL 5-1212  [TEL_5-XXYY_SINGLE]
U6  TPS5430DDAR  [HSOP8]
U7  LM1117-3.3V  [SOT223]

### Nets
+3P3_S: C64.2 C65.2 U7.2,4(OUT)
+5_S: C58.2 C59.2 C61.1 C62.2 C63.2 L2.2 R24.1 U7.3(IN)
+12_S: C53.2 C54.2 C56.2 C57.2 C60.1 R22.2 U5.14(Vout+) U6.7(VIN)
+V_SYS: C50.2 C51.2 C52.2 U5.22(Vin+) U5.23(Vin+)
GND: C50.1 C51.1 C52.1 C60.2 U5.2(Vin-) U5.3(Vin-)
GND_S: C53.1 C54.1 C56.1 C57.1 C58.1 C59.1 C61.2 C62.1 C63.1 C64.1 C65.1 D4.1(A) R23.1 R25.1 U5.16(Vout-) U6.2,3,6,9(GND) U7.1(GND)
NetC55_1: C55.1 D4.2(K) L2.1 U6.8(SW)
NetC55_2: C55.2 U6.1(BOOT)
NetR22_1: R22.1 R23.2 U6.5(EN)
NetR24_2: R24.2 R25.2 U6.4(FB)

### Library data of the parts
C50 C51 C53 C56 C58 C62 C64 = CN: 0603W106M250XD; PN: 0603W106M250XD
C52 C54 C57 C59 C63 C65 = CN: CL10B104KA8NNNC; PN: CL10B104KA8NNNC
C55 = CN: CL10B103KB8NNNC; PN: CL10B103KB8NNNC
C60 = CN-SMD: TAJD107K020RNJ; PN: TAJD107K020RNJ; LatestRevisionDate: 17-Jul-2002; LatestRevisionNote: Re-released for DXP Platform.; PackageReference: POLAR0.8; Publisher: Altium Limited
C61 = CN-SMD: TAJE477K010RNJ; PN: TAJE477K010RNJ; LatestRevisionDate: 17-Jul-2002; LatestRevisionNote: Re-released for DXP Platform.; PackageReference: POLAR0.8; Publisher: Altium Limited
D4 = Diode SMD: Code - JEDEC: DO-214-AB; Published: 8-Jun-2000; Revision: July-2002: Re-released for DXP Platform.; Publisher: Altium Limited; PN: SK34A
L2 = L-SMD-1: FIXED IND 22UH 2.5A 170 MOHM SMD, P/N: SRP7050TA-220M; Manufacturer: Wurth Elektronik; PN: SRP7050TA-220M; Inductance: 22 μH; ComponentLink1Description: Manufacturer; ComponentLink1URL: http://www.we-online.de; Created by: Baojun Chen; Created Date: Nov.2015; ComponentLink2Description: Datasheet; ComponentLink2URL: http://katalog.we-online.de/pbs/datasheet/78477010.pdf
R22 = Res-SMD: ERJ-3EKF4702V; Manufacturer: Generic Components; Class: Passive; PN: ERJ-3EKF4702V; Publisher: Altium Hobart Technology Centre
R23 R24 = Res-SMD: as R206 on sheet MAIN; PN: ERJ-3EKF1002V; Publisher: Altium Hobart Technology Centre
R25 = Res-SMD: ERJ-3EKF3241V; Manufacturer: Generic Components; Class: Passive; PN: ERJ-3EKF3241V; Publisher: Altium Hobart Technology Centre
U5 = TEL 5-1212: DC DC CONVERTER 12V 6W; PN: TEL 5-1212
U6 = TPS5430: IC REG BUCK ADJ 3A 8SOPWR, P/N: TPS5430DDAR; PN: TPS5430DDAR
U7 = LM1117: TLV1117-33IDCYR; PN: TLV1117-33IDCYR; Website: http://group3i.net

## Sheet PRIMARY_POWER.SchDoc
size A; SheetNumber: 6; SheetTotal: 21
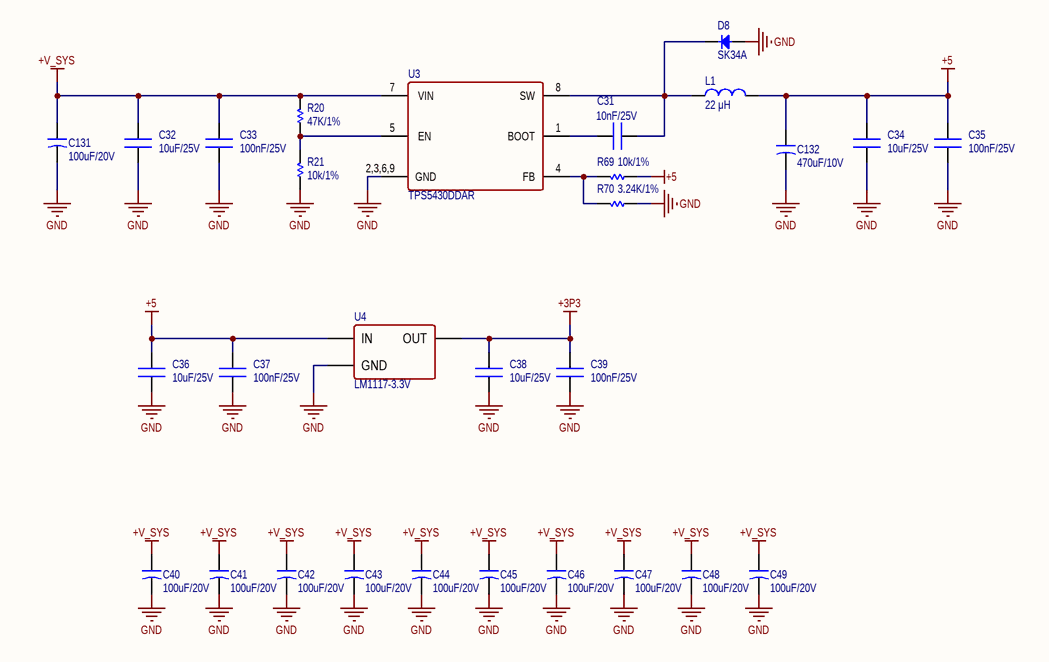
[diagram p9: PRIMARY_POWER.SchDoc]

### Parts
C31  10nF/25V  [CN-SMD-0603]
C32  10uF/25V  [CN-SMD-0603]
C33  100nF/25V  [CN-SMD-0603]
C34  10uF/25V  [CN-SMD-0603]
C35  100nF/25V  [CN-SMD-0603]
C36  10uF/25V  [CN-SMD-0603]
C37  100nF/25V  [CN-SMD-0603]
C38  10uF/25V  [CN-SMD-0603]
C39  100nF/25V  [CN-SMD-0603]
C40  100uF/20V  [Tantalum 2917]
C41  100uF/20V  [Tantalum 2917]
C42  100uF/20V  [Tantalum 2917]
C43  100uF/20V  [Tantalum 2917]
C44  100uF/20V  [Tantalum 2917]
C45  100uF/20V  [Tantalum 2917]
C46  100uF/20V  [Tantalum 2917]
C47  100uF/20V  [Tantalum 2917]
C48  100uF/20V  [Tantalum 2917]
C49  100uF/20V  [Tantalum 2917]
C131  100uF/20V  [Tantalum 2917]
C132  470uF/10V  [Tantalum 2917]
D8  SK34A  [DIO-SMD-A]
L1  22 μH  [PSM6050]
R20  47K/1%  [RES-SMD-0603]
R21  10k/1%  [RES-SMD-0603]
R69  10k/1%  [RES-SMD-0603]
R70  3.24K/1%  [RES-SMD-0603]
U3  TPS5430DDAR  [HSOP8]
U4  LM1117-3.3V  [SOT223]

### Nets
+3P3: C38.2 C39.2 U4.2,4(OUT)
+5: C34.2 C35.2 C36.2 C37.2 C132.1 L1.2 R69.1 U4.3(IN)
+V_SYS: C32.2 C33.2 C40.1 C41.1 C42.1 C43.1 C44.1 C45.1 C46.1 C47.1 C48.1 C49.1 C131.1 R20.2 U3.7(VIN)
GND: C32.1 C33.1 C34.1 C35.1 C36.1 C37.1 C38.1 C39.1 C40.2 C41.2 C42.2 C43.2 C44.2 C45.2 C46.2 C47.2 C48.2 C49.2 C131.2 C132.2 D8.1(A) R21.1 R70.1 U3.2,3,6,9(GND) U4.1(GND)
NetC31_1: C31.1 D8.2(K) L1.1 U3.8(SW)
NetC31_2: C31.2 U3.1(BOOT)
NetR20_1: R20.1 R21.2 U3.5(EN)
NetR69_2: R69.2 R70.2 U3.4(FB)

### Library data of the parts
C31 = CN: CL10B103KB8NNNC; PN: CL10B103KB8NNNC
C32 C34 C36 C38 = CN: 0603W106M250XD; PN: 0603W106M250XD
C33 C35 C37 C39 = CN: CL10B104KA8NNNC; PN: CL10B104KA8NNNC
C40-C49 C131 = CN-SMD: TAJD107K020RNJ; PN: TAJD107K020RNJ; LatestRevisionDate: 17-Jul-2002; LatestRevisionNote: Re-released for DXP Platform.; PackageReference: POLAR0.8; Publisher: Altium Limited
C132 = CN-SMD: TAJE477K010RNJ; PN: TAJE477K010RNJ; LatestRevisionDate: 17-Jul-2002; LatestRevisionNote: Re-released for DXP Platform.; PackageReference: POLAR0.8; Publisher: Altium Limited
D8 = Diode SMD: Code - JEDEC: DO-214-AB; Published: 8-Jun-2000; Revision: July-2002: Re-released for DXP Platform.; Publisher: Altium Limited; PN: SK34A
L1 = L-SMD-1: as L2 on sheet SECONDARY_POWER; PN: SRP7050TA-220M; Inductance: 22 μH; ComponentLink1Description: Manufacturer; ComponentLink1URL: http://www.we-online.de; Created by: Baojun Chen; Created Date: Nov.2015; ComponentLink2Description: Datasheet; ComponentLink2URL: http://katalog.we-online.de/pbs/datasheet/78477010.pdf
R20 = Res-SMD: as R22 on sheet SECONDARY_POWER; PN: ERJ-3EKF4702V; Publisher: Altium Hobart Technology Centre
R21 R69 = Res-SMD: as R206 on sheet MAIN; PN: ERJ-3EKF1002V; Publisher: Altium Hobart Technology Centre
R70 = Res-SMD: as R25 on sheet SECONDARY_POWER; PN: ERJ-3EKF3241V; Publisher: Altium Hobart Technology Centre
U3 = TPS5430: as U6 on sheet SECONDARY_POWER; PN: TPS5430DDAR
U4 = LM1117: TLV1117-33IDCYR; PN: TLV1117-33IDCYR; Website: http://group3i.net

## Sheet ACCELEROMETER.SchDoc
size A; SheetNumber: 11; SheetTotal: 21
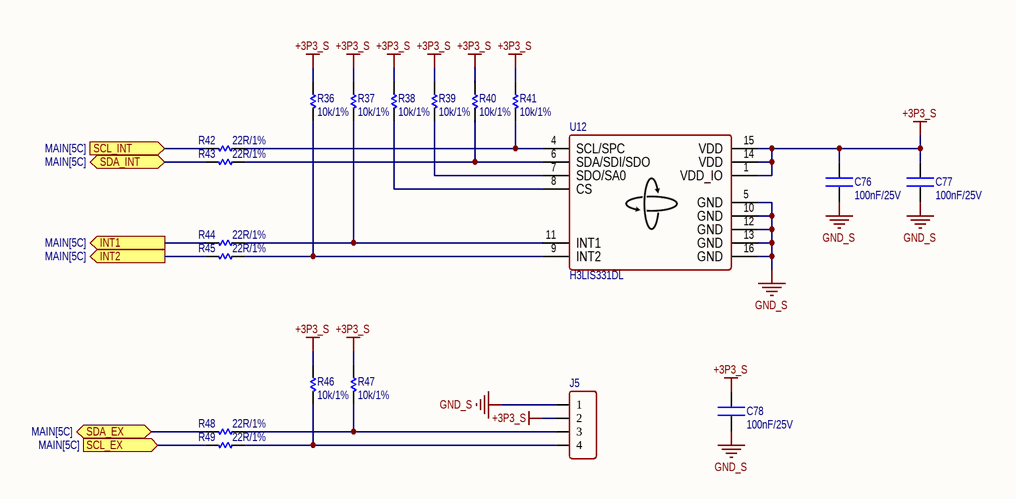
[diagram p10: ACCELEROMETER.SchDoc]

### Parts
C76  100nF/25V  [CN-SMD-0603]
C77  100nF/25V  [CN-SMD-0603]
C78  100nF/25V  [CN-SMD-0603]
J5  SM04B-SRSS-TBLFSN  [BM04B-SRSS-TB]  (value not drawn)
R36  10k/1%  [RES-SMD-0603]
R37  10k/1%  [RES-SMD-0603]
R38  10k/1%  [RES-SMD-0603]
R39  10k/1%  [RES-SMD-0603]
R40  10k/1%  [RES-SMD-0603]
R41  10k/1%  [RES-SMD-0603]
R42  22R/1%  [RES-SMD-0603]
R43  22R/1%  [RES-SMD-0603]
R44  22R/1%  [RES-SMD-0603]
R45  22R/1%  [RES-SMD-0603]
R46  10k/1%  [RES-SMD-0603]
R47  10k/1%  [RES-SMD-0603]
R48  22R/1%  [RES-SMD-0603]
R49  22R/1%  [RES-SMD-0603]
U12  H3LIS331DL  [TFLGA-16L]

### Ports
INT1 (out, see MAIN[5C]), INT2 (out, see MAIN[5C]), SCL_EX (in, see MAIN[5C]), SCL_INT (in, see MAIN[5C]), SDA_EX (bidir, see MAIN[5C]), SDA_INT (bidir, see MAIN[5C])

### Nets
+3P3_S: C76.2 C77.2 C78.2 J5.2 R36.1 R37.1 R38.1 R39.1 R40.1 R41.1 R46.1 R47.1 U12.1(VDD_IO) U12.14(VDD) U12.15(VDD)
GND_S: C76.1 C77.1 C78.1 J5.1 U12.5(GND) U12.10(GND) U12.12(GND) U12.13(GND) U12.16(GND)
ONBOARD_SEN_INT_1: R44.2 ; port INT1
ONBOARD_SEN_INT_2: R45.2 ; port INT2
ONBOARD_SEN_SCL: R42.2 ; port SCL_INT
ONBOARD_SEN_SDA: R43.2 ; port SDA_INT
SENSOR_SCL: R49.2 ; port SCL_EX
SENSOR_SDA: R48.2 ; port SDA_EX
NetJ5_3: J5.3 R47.2 R48.1
NetJ5_4: J5.4 R46.2 R49.1
NetR36_2: R36.2 R45.1 U12.9(INT2)
NetR37_2: R37.2 R44.1 U12.11(INT1)
NetR38_2: R38.2 U12.8(CS)
NetR39_2: R39.2 U12.7(SDO/SA0)
NetR40_2: R40.2 R43.1 U12.6(SDA/SDI/SDO)
NetR41_2: R41.2 R42.1 U12.4(SCL/SPC)

### Library data of the parts
C76-C78 = CN: CL10B104KA8NNNC; PN: CL10B104KA8NNNC
J5 = Header4: ComponentLink1 Description: Manufacturer; ComponentLink2 Description: Datasheet; ComponentLink1URL: http://www.we-online.com; ComponentLink2URL: http://katalog.we-online.de/em/datasheet/6130xx143121.pdf; PN: SM04B-SRSS-TBLFSN
R36-R41 R46 R47 = Res-SMD: as R206 on sheet MAIN; PN: ERJ-3EKF1002V; Publisher: Altium Hobart Technology Centre
R42-R45 R48 R49 = Res-SMD: ERJ-3EKF22R0V; PN: ERJ-3EKF22R0V
U12 = H3LIS331DL: High-g, low-power 3-axis digital accelerometer; PN: H3LIS331DL

## Sheet ANALOG.SchDoc
size A; SheetNumber: 12; SheetTotal: 21
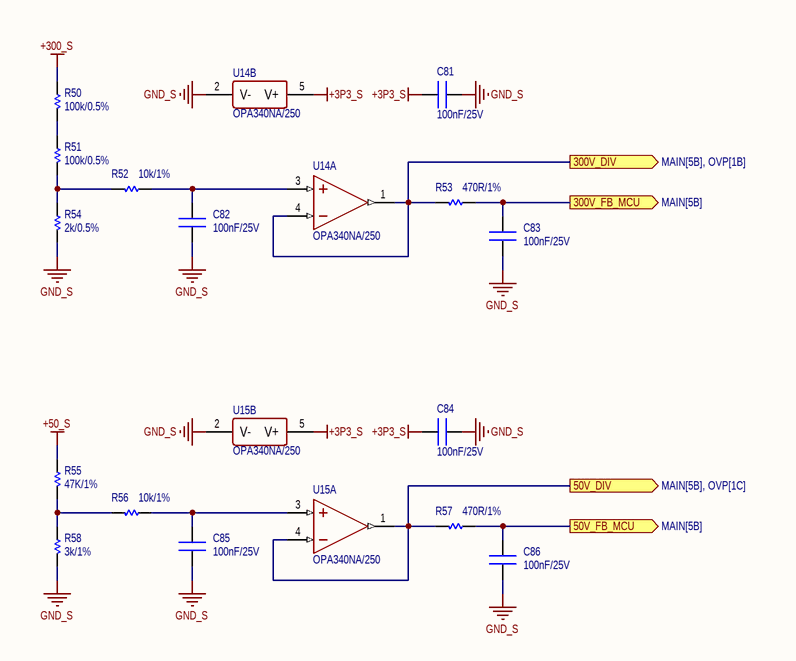
[diagram p11: ANALOG.SchDoc]

### Parts
C81  100nF/25V  [CN-SMD-0603]
C82  100nF/25V  [CN-SMD-0603]
C83  100nF/25V  [CN-SMD-0603]
C84  100nF/25V  [CN-SMD-0603]
C85  100nF/25V  [CN-SMD-0603]
C86  100nF/25V  [CN-SMD-0603]
R50  100k/0.5%  [RES-SMD-2010]
R51  100k/0.5%  [RES-SMD-2010]
R52  10k/1%  [RES-SMD-0603]
R53  470R/1%  [RES-SMD-0603]
R54  2k/0.5%  [RES-SMD-2010]
R55  47K/1%  [RES-SMD-0603]
R56  10k/1%  [RES-SMD-0603]
R57  470R/1%  [RES-SMD-0603]
R58  3k/1%  [RES-SMD-0603]
U14  OPA340NA/250  [SOT23-5]  (parts A,B of 2)
U15  OPA340NA/250  [SOT23-5]  (parts A,B of 2)

### Ports
50V_DIV (out, see MAIN[5B], OVP[1C]), 50V_FB_MCU (out, see MAIN[5B]), 300V_DIV (out, see MAIN[5B], OVP[1B]), 300V_FB_MCU (out, see MAIN[5B])

### Nets
+3P3_S: C81.1 C84.1 U14.5(V+) U15.5(V+)
+50_S: R55.1
+300_S: R50.1
GND_S: C81.2 C82.2 C83.2 C84.2 C85.2 C86.2 R54.2 R58.2 U14.2(V-) U15.2(V-)
50V_FB_MCU: C86.1 R57.1 ; port 50V_FB_MCU
300V_FB_MCU: C83.1 R53.1 ; port 300V_FB_MCU
NetC82_1: C82.1 R52.1 U14.3(IN+)
NetC85_1: C85.1 R56.1 U15.3(IN+)
NetR50_2: R50.2 R51.1
NetR51_2: R51.2 R52.2 R54.1
NetR53_2: R53.2 U14.1(OUT) U14.4(IN-) ; port 300V_DIV
NetR55_2: R55.2 R56.2 R58.1
NetR57_2: R57.2 U15.1(OUT) U15.4(IN-) ; port 50V_DIV

### Library data of the parts
C81-C86 = CN: CL10B104KA8NNNC; PN: CL10B104KA8NNNC
R50 R51 = Res-SMD: CHV2010-JW-104ELF; Manufacturer: Generic Components; Class: Passive; PN: CHV2010-JW-104ELF; Publisher: Altium Hobart Technology Centre
R52 R56 = Res-SMD: as R206 on sheet MAIN; PN: ERJ-3EKF1002V; Publisher: Altium Hobart Technology Centre
R53 R57 = Res-SMD: as R26 on sheet EXTERNAL_FAN; PN: ERJ-1GJF4700C; Publisher: Altium Hobart Technology Centre
R54 = Res-SMD: CRCW20102K00FKEFHP; Manufacturer: Generic Components; Class: Passive; PN: CRCW20102K00FKEFHP; Publisher: Altium Hobart Technology Centre
R55 = Res-SMD: as R22 on sheet SECONDARY_POWER; PN: ERJ-3EKF4702V; Publisher: Altium Hobart Technology Centre
R58 = Res-SMD: ERA-3AEB302V; Manufacturer: Generic Components; Class: Passive; PN: ERA-3AEB302V; Publisher: Altium Hobart Technology Centre
U14 U15 = OPA340DBV: PN: OPA340NA/250

## Sheet OVP.SchDoc
size A; SheetNumber: 13; SheetTotal: 21
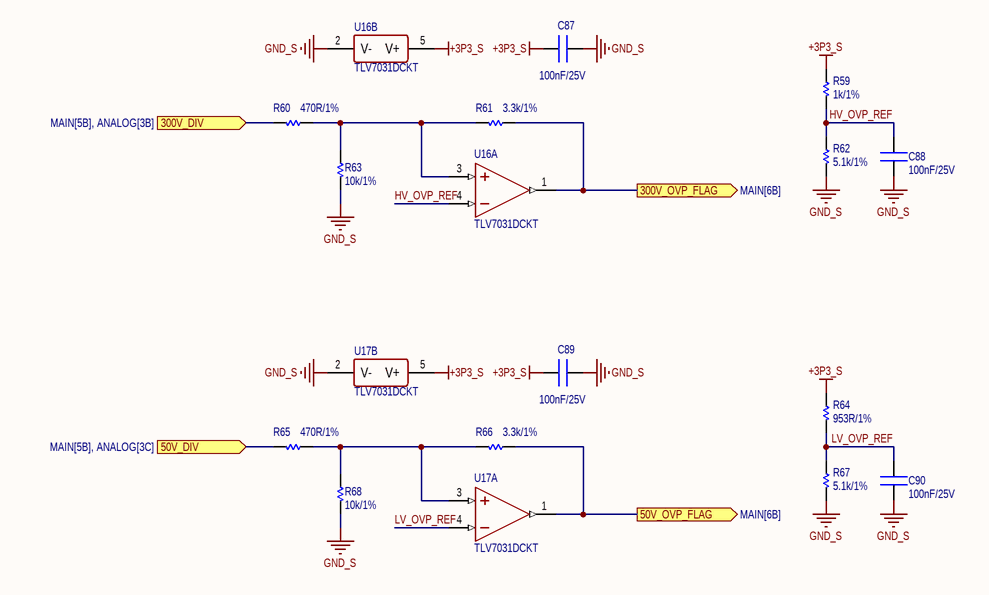
[diagram p12: OVP.SchDoc]

### Parts
C87  100nF/25V  [CN-SMD-0603]
C88  100nF/25V  [CN-SMD-0603]
C89  100nF/25V  [CN-SMD-0603]
C90  100nF/25V  [CN-SMD-0603]
R59  1k/1%  [RES-SMD-0603]
R60  470R/1%  [RES-SMD-0603]
R61  3.3k/1%  [RES-SMD-0603]
R62  5.1k/1%  [RES-SMD-0603]
R63  10k/1%  [RES-SMD-0603]
R64  953R/1%  [RES-SMD-0603]
R65  470R/1%  [RES-SMD-0603]
R66  3.3k/1%  [RES-SMD-0603]
R67  5.1k/1%  [RES-SMD-0603]
R68  10k/1%  [RES-SMD-0603]
U16  TLV7031DCKT  [SOT353]  (parts A,B of 2)
U17  TLV7031DCKT  [SOT353]  (parts A,B of 2)

### Ports
50V_DIV (in, see MAIN[5B], ANALOG[3C]), 50V_OVP_FLAG (out, see MAIN[6B]), 300V_DIV (in, see MAIN[5B], ANALOG[3B]), 300V_OVP_FLAG (out, see MAIN[6B])

### Nets
+3P3_S: C87.1 C89.1 R59.1 R64.1 U16.5(V+) U17.5(V+)
GND_S: C87.2 C88.1 C89.2 C90.1 R62.2 R63.2 R67.2 R68.2 U16.2(V-) U17.2(V-)
HV_OVP_REF: C88.2 R59.2 R62.1 U16.4(IN-)
LV_OVP_REF: C90.2 R64.2 R67.1 U17.4(IN-)
OVP_MCU_50: R66.1 U17.1(OUT) ; port 50V_OVP_FLAG
OVP_MCU_300: R61.1 U16.1(OUT) ; port 300V_OVP_FLAG
NetR53_2: R60.2 ; port 300V_DIV
NetR57_2: R65.2 ; port 50V_DIV
NetR60_1: R60.1 R61.2 R63.1 U16.3(IN+)
NetR65_1: R65.1 R66.2 R68.1 U17.3(IN+)

### Library data of the parts
C87-C90 = CN: CL10B104KA8NNNC; PN: CL10B104KA8NNNC
R59 = Res-SMD: as R31 on sheet MAIN; PN: ERJ-3EKF1001V; Publisher: Altium Hobart Technology Centre
R60 R65 = Res-SMD: as R26 on sheet EXTERNAL_FAN; PN: ERJ-1GJF4700C; Publisher: Altium Hobart Technology Centre
R61 R66 = Res-SMD: ERJ-3EKF3301V; Manufacturer: Generic Components; Class: Passive; PN: ERJ-3EKF3301V; Publisher: Altium Hobart Technology Centre
R62 R67 = Res-SMD: ERJ-3EKF5101V; Manufacturer: Generic Components; Class: Passive; PN: ERJ-3EKF5101V; Publisher: Altium Hobart Technology Centre
R63 R68 = Res-SMD: as R206 on sheet MAIN; PN: ERJ-3EKF1002V; Publisher: Altium Hobart Technology Centre
R64 = Res-SMD: ERJ-3EKF9530V; Manufacturer: Generic Components; Class: Passive; PN: ERJ-3EKF9530V; Publisher: Altium Hobart Technology Centre
U16 U17 = OPA340DBV: PN: TLV7031DCKT

## Sheet CAP_RELEASE.SchDoc
size A; SheetNumber: 14; SheetTotal: 21
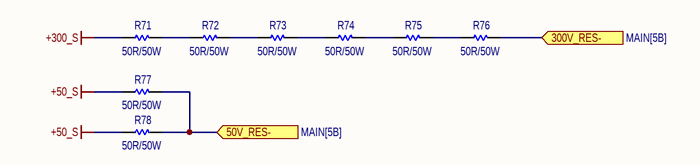
[diagram p13: CAP_RELEASE.SchDoc]

### Parts
R71  50R/50W  [TO263-123]
R72  50R/50W  [TO263-123]
R73  50R/50W  [TO263-123]
R74  50R/50W  [TO263-123]
R75  50R/50W  [TO263-123]
R76  50R/50W  [TO263-123]
R77  50R/50W  [TO263-123]
R78  50R/50W  [TO263-123]

### Ports
50V_RES- (in, see MAIN[5B]), 300V_RES- (in, see MAIN[5B])

### Nets
+50_S: R77.1 R78.1
+300_S: R71.1
NetQ2A_2: R76.2 ; port 300V_RES-
NetQ2B_2: R77.2 R78.2 ; port 50V_RES-
NetR71_2: R71.2 R72.1
NetR72_2: R72.2 R73.1
NetR73_2: R73.2 R74.1
NetR74_2: R74.2 R75.1
NetR75_2: R75.2 R76.1

### Library data of the parts
R71-R78 = Res-SMD: TPAN0263F50R0K9; pin to pad: 2>3; Manufacturer: Generic Components; Class: Passive; PN: TPAN0263F50R0K9; Publisher: Altium Hobart Technology Centre

## Sheet XBEE.SchDoc
size A; SheetNumber: 15; SheetTotal: 21
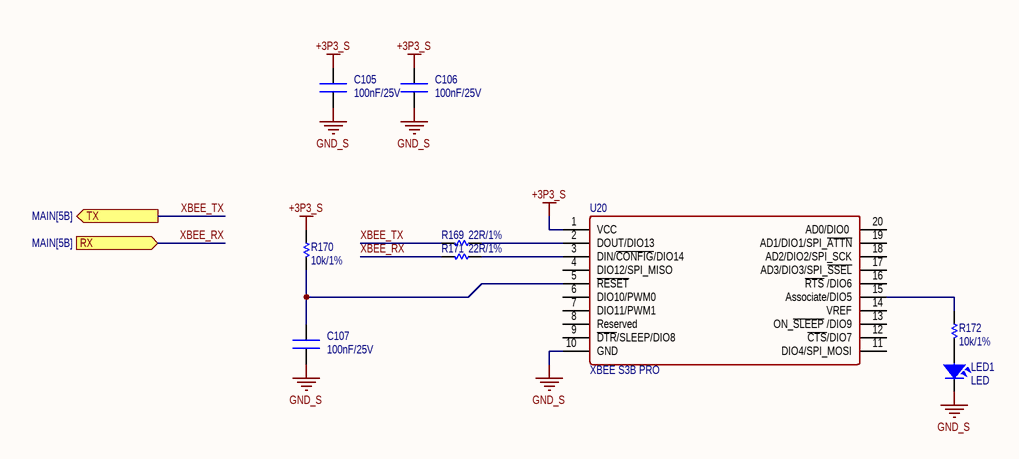
[diagram p14: XBEE.SchDoc]

### Parts
C105  100nF/25V  [CN-SMD-0603]
C106  100nF/25V  [CN-SMD-0603]
C107  100nF/25V  [CN-SMD-0603]
LED1  LED  [LED-0805-Red]
R169  22R/1%  [RES-SMD-0603]
R170  10k/1%  [RES-SMD-0603]
R171  22R/1%  [RES-SMD-0603]
R172  10k/1%  [RES-SMD-0603]
U20  XBEE S3B PRO  [XBEE S3B PRO DIP]

### Ports
RX (in, see MAIN[5B]), TX (out, see MAIN[5B])

### Nets
+3P3_S: C105.2 C106.2 R170.1 U20.1(VCC)
GND_S: C105.1 C106.1 C107.1 LED1.2 U20.10(GND)
XBEE_RX: R171.2 ; port RX
XBEE_TX: R169.2 ; port TX
NetC107_2: C107.2 R170.2 U20.5(~{RESET})
NetLED1_1: LED1.1 R172.2
NetR169_1: R169.1 U20.2(DOUT/DIO13)
NetR171_1: R171.1 U20.3(DIN/~{CONFIG}/DIO14)
NetR172_1: R172.1 U20.15(Associate/DIO5)

Not connected (* = marked no-connect by the designer): U20 4(DIO12/SPI_MISO) 6(DIO10/PWM0) 7(DIO11/PWM1) 8(Reserved) 9(~{DTR}/SLEEP/DIO8) 11(DIO4/SPI_MOSI) 12(~{CTS}/DIO7) 13(ON_~{SLEEP}_/DIO9) 14(VREF) 16(~{RTS}_/DIO6) 17(AD3/DIO3/SPI_~{SSEL}) 18(AD2/DIO2/SPI_SCK) 19(AD1/DIO1/SPI_~{ATTN}) 20(AD0/DIO0_)

### Library data of the parts
C105-C107 = CN: CL10B104KA8NNNC; PN: CL10B104KA8NNNC
LED1 = LED SMD: Value: LED 3 - 5 ly 2 Colour
R169 R171 = Res-SMD: ERJ-3EKF22R0V; PN: ERJ-3EKF22R0V
R170 R172 = Res-SMD: as R206 on sheet MAIN; PN: ERJ-3EKF1002V; Publisher: Altium Hobart Technology Centre

## Sheet POWER_CON.SchDoc
size A; SheetNumber: 15; SheetTotal: 20
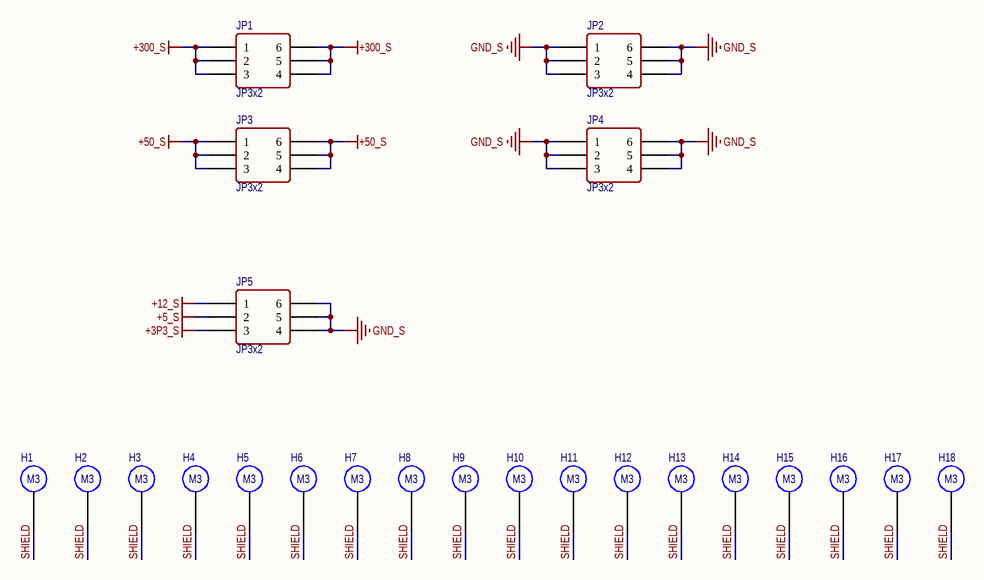
[diagram p15: POWER_CON.SchDoc]

### Parts
H1  M3  [M3]  (no BOM)
H2  M3  [M3]  (no BOM)
H3  M3  [M3]  (no BOM)
H4  M3  [M3]  (no BOM)
H5  M3  [M3]  (no BOM)
H6  M3  [M3]  (no BOM)
H7  M3  [M3]  (no BOM)
H8  M3  [M3]  (no BOM)
H9  M3  [M3]  (no BOM)
H10  M3  [M3]  (no BOM)
H11  M3  [M3]  (no BOM)
H12  M3  [M3]  (no BOM)
H13  M3  [M3]  (no BOM)
H14  M3  [M3]  (no BOM)
H15  M3  [M3]  (no BOM)
H16  M3  [M3]  (no BOM)
H17  M3  [M3]  (no BOM)
H18  M3  [M3]  (no BOM)
JP1  JP3x2  [JP3-D2T]
JP2  JP3x2  [JP3-D2T]
JP3  JP3x2  [JP3-D2T]
JP4  JP3x2  [JP3-D2T]
JP5  JP3x2  [JP3-D2T]

### Nets
+3P3_S: JP5.3
+5_S: JP5.2
+12_S: JP5.1
+50_S: JP3.1 JP3.2 JP3.3 JP3.4 JP3.5 JP3.6
+300_S: JP1.1 JP1.2 JP1.3 JP1.4 JP1.5 JP1.6
GND_S: JP2.1 JP2.2 JP2.3 JP2.4 JP2.5 JP2.6 JP4.1 JP4.2 JP4.3 JP4.4 JP4.5 JP4.6 JP5.4 JP5.5 JP5.6
SHIELD: H1.1 H2.1 H3.1 H4.1 H5.1 H6.1 H7.1 H8.1 H9.1 H10.1 H11.1 H12.1 H13.1 H14.1 H15.1 H16.1 H17.1 H18.1

### Library data of the parts
JP1-JP5 = JP3x2: 5-534206-3; Manufacturer: W¨¹rth Elektronik eiSos GmbH; partNo: 61300621821; ComponentLink1 Description: Manufacturer; ComponentLink2 Description: Datasheet; NoPins: 06; Created Date: 29 March 2013; ComponentLink1URL: http://www.we-online.com; ComponentLink2URL: http://katalog.we-online.de/em/datasheet/6130xx21821.pdf; Created by: Karrer Zheng

## Sheet COMUNICATE_CON.SchDoc
size A; SheetNumber: 17; SheetTotal: 21
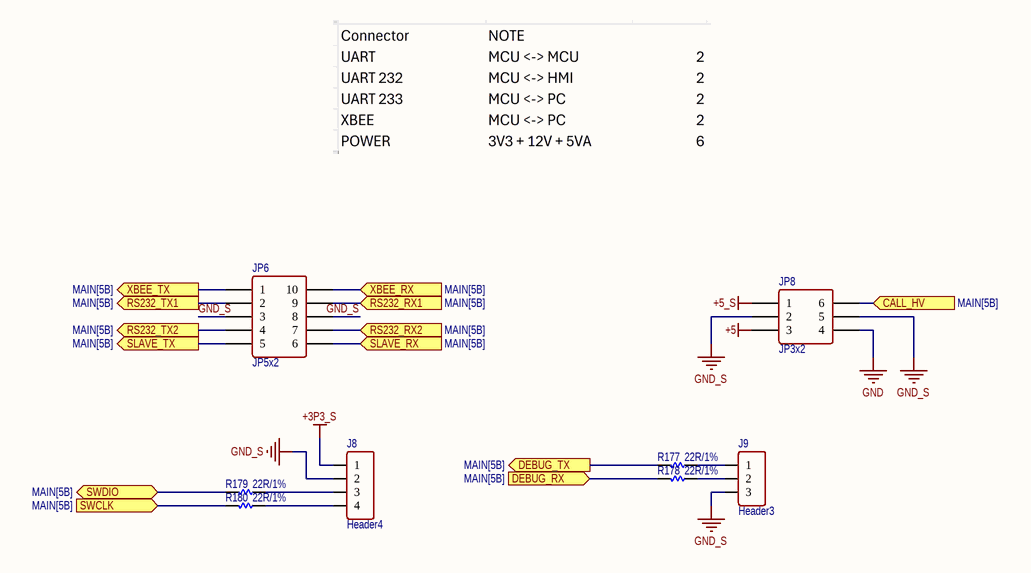
[diagram p16: COMUNICATE_CON.SchDoc]

### Parts
J8  Header4  [XH2.54-4-DIP]
J9  Header3  [XH2.54-3-DIP]
JP6  JP5x2  [JP5-D2T]
JP8  JP3x2  [JP3-C2T]
R177  22R/1%  [RES-SMD-0603]
R178  22R/1%  [RES-SMD-0603]
R179  22R/1%  [RES-SMD-0603]
R180  22R/1%  [RES-SMD-0603]

### Ports
CALL_HV (in, see MAIN[5B]), DEBUG_RX (in, see MAIN[5B]), DEBUG_TX (out, see MAIN[5B]), RS232_RX1 (in, see MAIN[5B]), RS232_RX2 (in, see MAIN[5B]), RS232_TX1 (out, see MAIN[5B]), RS232_TX2 (out, see MAIN[5B]), SLAVE_RX (in, see MAIN[5B]), SLAVE_TX (out, see MAIN[5B]), SWCLK (in, see MAIN[5B]), SWDIO (bidir, see MAIN[5B]), XBEE_RX (in, see MAIN[5B]), XBEE_TX (out, see MAIN[5B])

### Nets
+3P3_S: J8.1
+5: JP8.3
+5_S: JP8.1
GND: JP8.4
GND_S: J8.2 J9.3 JP6.3 JP6.8 JP8.2 JP8.5
CALL_HV: JP8.6 ; port CALL_HV
DEBUG_RX: R178.2 ; port DEBUG_RX
DEBUG_TX: R177.2 ; port DEBUG_TX
RS232_RX1: JP6.9 ; port RS232_RX1
RS232_RX2: JP6.7 ; port RS232_RX2
RS232_TX1: JP6.2 ; port RS232_TX1
RS232_TX2: JP6.4 ; port RS232_TX2
SLAVE_RX: JP6.6 ; port SLAVE_RX
SLAVE_TX: JP6.5 ; port SLAVE_TX
SWCLK: R180.2 ; port SWCLK
SWDIO: R179.2 ; port SWDIO
XBEE_RX: JP6.10 ; port XBEE_RX
XBEE_TX: JP6.1 ; port XBEE_TX
NetJ8_3: J8.3 R179.1
NetJ8_4: J8.4 R180.1
NetJ9_1: J9.1 R177.1
NetJ9_2: J9.2 R178.1

### Library data of the parts
J8 = Header4: as J15 on sheet USB_ISOLATE; Created Date: 29 March 2013; ComponentLink1URL: http://www.we-online.com; ComponentLink2URL: http://katalog.we-online.de/em/datasheet/6130xx143121.pdf; Created by: Karrer Zheng
J9 = Header3: Connector 3; Manufacturer: W¨¹rth Elektronik eiSos GmbH; partNo: 613002143121; ComponentLink1 Description: Manufacturer; ComponentLink2 Description: Datasheet; NoPins: 02; Created Date: 29 March 2013; ComponentLink1URL: http://www.we-online.com; ComponentLink2URL: http://katalog.we-online.de/em/datasheet/6130xx143121.pdf; Created by: Karrer Zheng
JP6 = JP5x2: WR-PHD 2.54 mm Dual Socket Header; Manufacturer: W¨¹rth Elektronik eiSos GmbH; partNo: 61301021821; ComponentLink1 Description: Manufacturer; ComponentLink2 Description: Datasheet; NoPins: 10; Created Date: 29 March 2013; ComponentLink1URL: http://www.we-online.com; ComponentLink2URL: http://katalog.we-online.de/em/datasheet/6130xx21821.pdf; Created by: Karrer Zheng
JP8 = JP3x2: as JP1 on sheet POWER_CON; Created Date: 29 March 2013; ComponentLink1URL: http://www.we-online.com; ComponentLink2URL: http://katalog.we-online.de/em/datasheet/6130xx21821.pdf; Created by: Karrer Zheng
R177-R180 = Res-SMD: ERJ-3EKF22R0V; PN: ERJ-3EKF22R0V

## Sheet PERIPHERAL_CON.SchDoc
size A; SheetNumber: 20; SheetTotal: 21
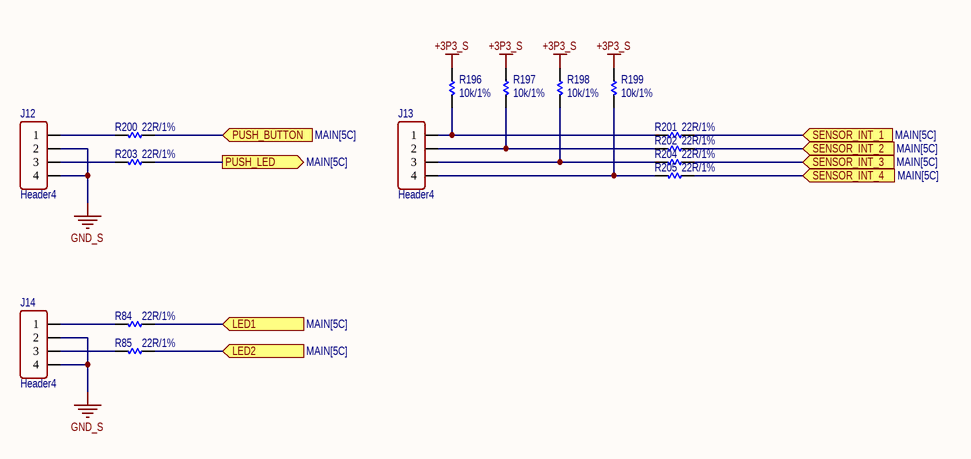
[diagram p17: PERIPHERAL_CON.SchDoc]

### Parts
J12  Header4  [XH2.54-4-DIP]
J13  Header4  [XH2.54-4-DIP]
J14  Header4  [XH2.54-4-DIP]
R84  22R/1%  [RES-SMD-0603]
R85  22R/1%  [RES-SMD-0603]
R196  10k/1%  [RES-SMD-0603]
R197  10k/1%  [RES-SMD-0603]
R198  10k/1%  [RES-SMD-0603]
R199  10k/1%  [RES-SMD-0603]
R200  22R/1%  [RES-SMD-0603]
R201  22R/1%  [RES-SMD-0603]
R202  22R/1%  [RES-SMD-0603]
R203  22R/1%  [RES-SMD-0603]
R204  22R/1%  [RES-SMD-0603]
R205  22R/1%  [RES-SMD-0603]

### Ports
LED1 (in, see MAIN[5C]), LED2 (in, see MAIN[5C]), PUSH_BUTTON (in, see MAIN[5C]), PUSH_LED (out, see MAIN[5C]), SENSOR_INT_1 (in, see MAIN[5C]), SENSOR_INT_2 (in, see MAIN[5C]), SENSOR_INT_3 (in, see MAIN[5C]), SENSOR_INT_4 (in, see MAIN[5C])

### Nets
+3P3_S: R196.1 R197.1 R198.1 R199.1
GND_S: J12.2 J12.4 J14.2 J14.4
LED1: R84.1 ; port LED1
LED2: R85.1 ; port LED2
PERIPH_PUSH_BUTTON: R200.1 ; port PUSH_BUTTON
PERIPH_PUSH_LED: R203.1 ; port PUSH_LED
SENSOR_INT_1: R201.1 ; port SENSOR_INT_1
SENSOR_INT_2: R202.1 ; port SENSOR_INT_2
SENSOR_INT_3: R204.1 ; port SENSOR_INT_3
SENSOR_INT_4: R205.1 ; port SENSOR_INT_4
NetJ12_1: J12.1 R200.2
NetJ12_3: J12.3 R203.2
NetJ13_1: J13.1 R196.2 R201.2
NetJ13_2: J13.2 R197.2 R202.2
NetJ13_3: J13.3 R198.2 R204.2
NetJ13_4: J13.4 R199.2 R205.2
NetJ14_1: J14.1 R84.2
NetJ14_3: J14.3 R85.2

### Library data of the parts
J12-J14 = Header4: as J15 on sheet USB_ISOLATE; Created Date: 29 March 2013; ComponentLink1URL: http://www.we-online.com; ComponentLink2URL: http://katalog.we-online.de/em/datasheet/6130xx143121.pdf; Created by: Karrer Zheng
R84 R85 R200-R205 = Res-SMD: ERJ-3EKF22R0V; PN: ERJ-3EKF22R0V
R196-R199 = Res-SMD: as R206 on sheet MAIN; PN: ERJ-3EKF1002V; Publisher: Altium Hobart Technology Centre

## Sheet CHARGER.SchDoc
size B; SheetNumber: 18; SheetTotal: 21
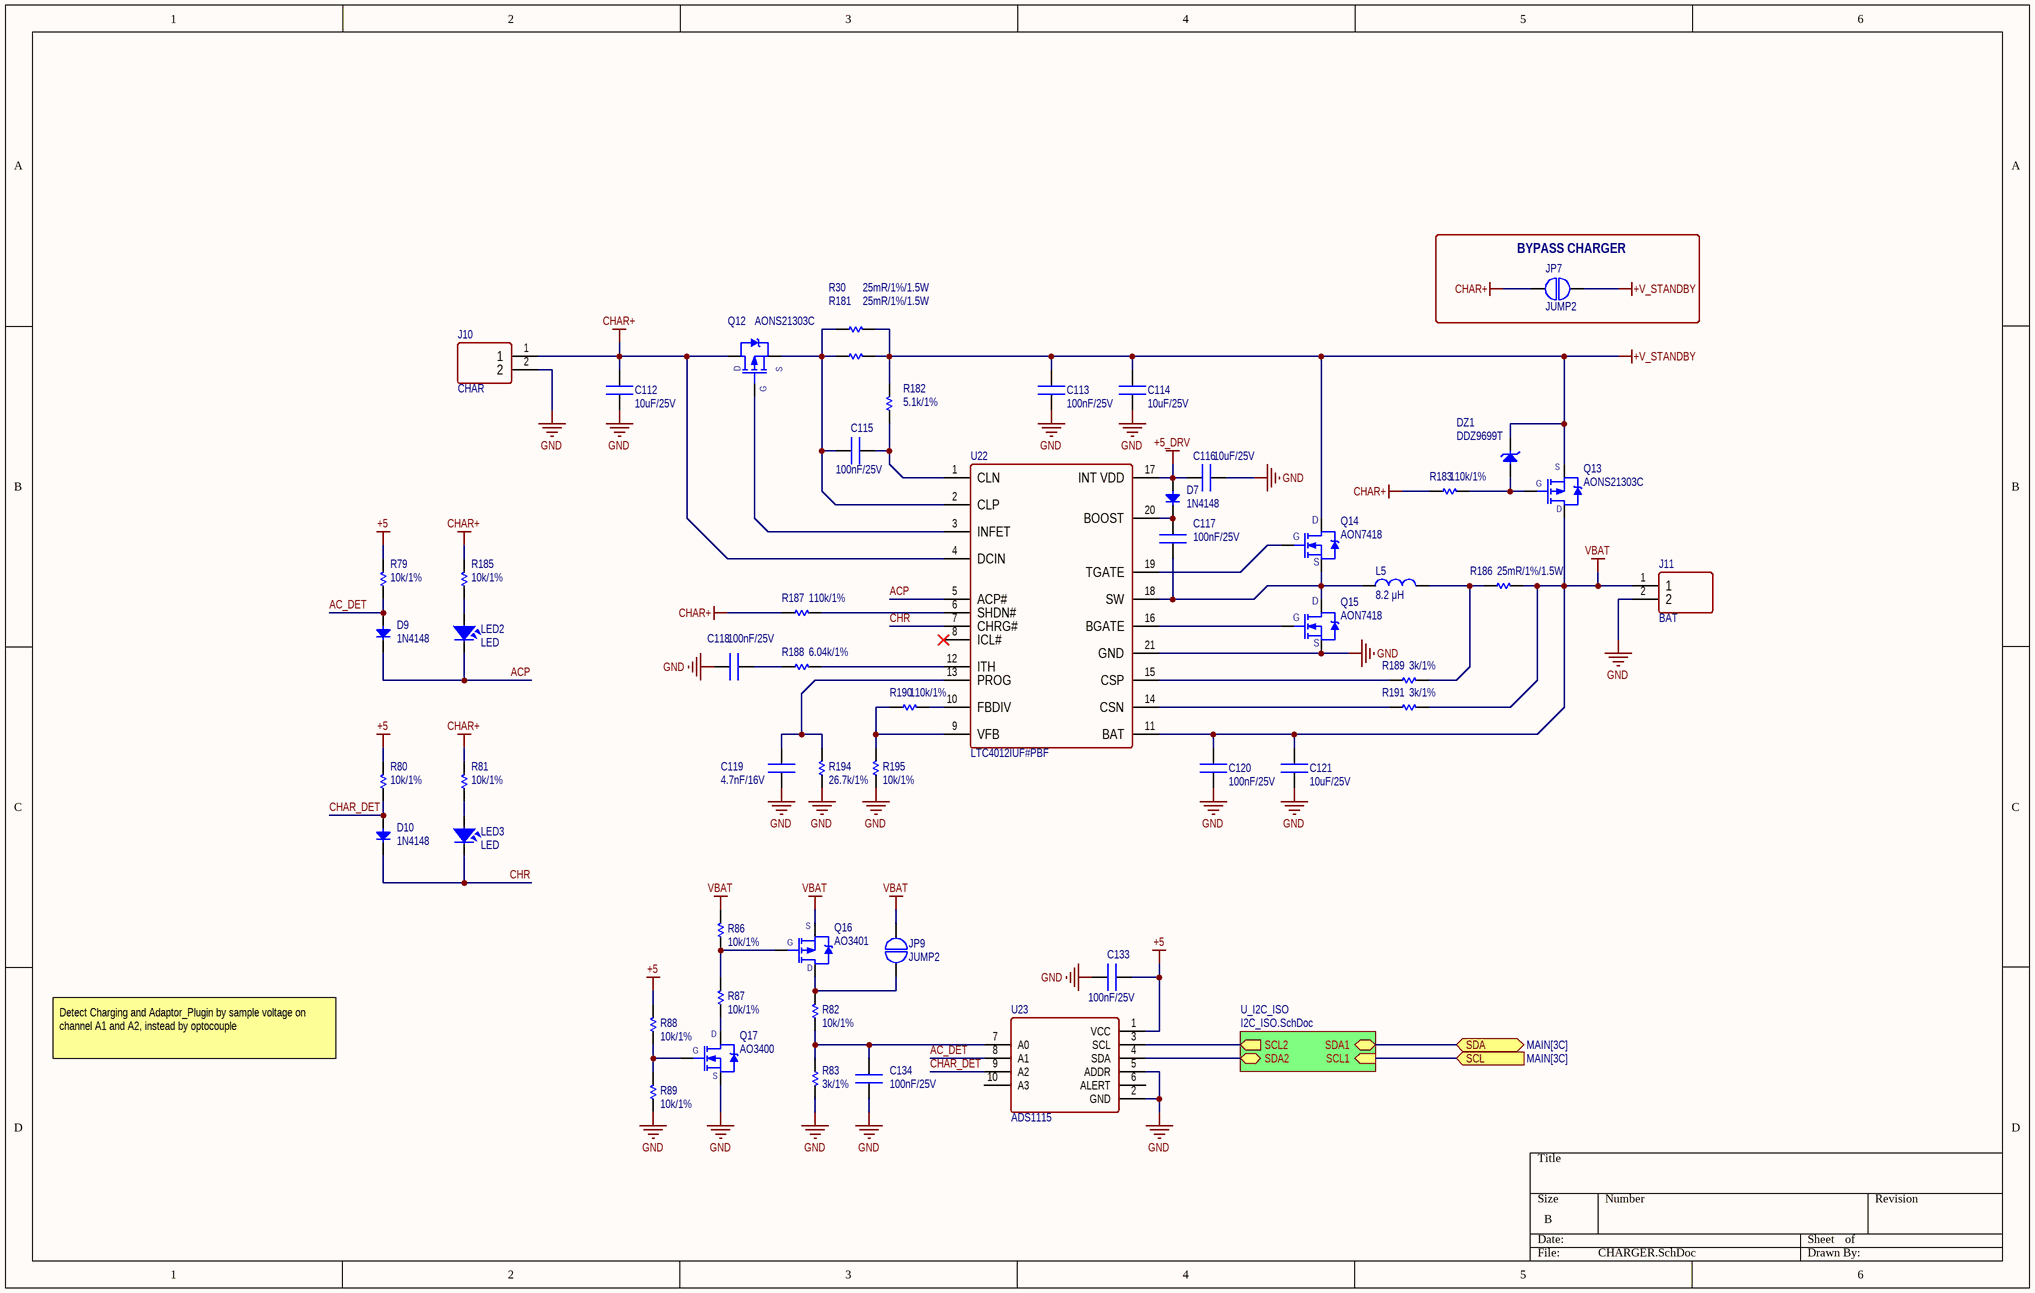
[diagram p18: CHARGER.SchDoc]

### Parts
C112  10uF/25V  [CN-SMD-0603]
C113  100nF/25V  [CN-SMD-0603]
C114  10uF/25V  [CN-SMD-0603]
C115  100nF/25V  [CN-SMD-0603]
C116  10uF/25V  [CN-SMD-0603]
C117  100nF/25V  [CN-SMD-0603]
C118  100nF/25V  [CN-SMD-0603]
C119  4.7nF/16V  [CN-SMD-0603]
C120  100nF/25V  [CN-SMD-0603]
C121  10uF/25V  [CN-SMD-0603]
C133  100nF/25V  [CN-SMD-0603]
C134  100nF/25V  [CN-SMD-0603]
D7  1N4148  [DIO-SMD-323]
D9  1N4148  [DIO-SMD-323]
D10  1N4148  [DIO-SMD-323]
DZ1  DDZ9699T  [DIO-SMD-523]
J10  CHAR  [S2P-VH(LF)(SN)]
J11  BAT  [S2P-VH(LF)(SN)]
JP7  JUMP2  [Jump2]  (no BOM)
JP9  JUMP2  [Jump2]  (no BOM)
L5  8.2 μH  [PSM1040]
LED2  LED  [LED-0805-Red]
LED3  LED  [LED-0805-Red]
Q12  AONS21303C  [PowerPAK SO-8 Single]
Q13  AONS21303C  [PowerPAK SO-8 Single]
Q14  AON7418  [DFN3.3x3.3_8L]
Q15  AON7418  [DFN3.3x3.3_8L]
Q16  AO3401  [SOT23-123]
Q17  AO3400  [SOT23-123]
R30  25mR/1%/1.5W  [RES-SMD-1206]
R79  10k/1%  [RES-SMD-0603]
R80  10k/1%  [RES-SMD-0603]
R81  10k/1%  [RES-SMD-0603]
R82  10k/1%  [RES-SMD-0603]
R83  3k/1%  [RES-SMD-0603]
R86  10k/1%  [RES-SMD-0603]
R87  10k/1%  [RES-SMD-0603]
R88  10k/1%  [RES-SMD-0603]
R89  10k/1%  [RES-SMD-0603]
R181  25mR/1%/1.5W  [RES-SMD-1206]
R182  5.1k/1%  [RES-SMD-0603]
R183  110k/1%  [RES-SMD-0603]
R185  10k/1%  [RES-SMD-0603]
R186  25mR/1%/1.5W  [RES-SMD-1206]
R187  110k/1%  [RES-SMD-0603]
R188  6.04k/1%  [RES-SMD-0603]
R189  3k/1%  [RES-SMD-0603]
R190  110k/1%  [RES-SMD-0603]
R191  3k/1%  [RES-SMD-0603]
R194  26.7k/1%  [RES-SMD-0603]
R195  10k/1%  [RES-SMD-0603]
U22  LTC4012IUF#PBF  [PQFN50P400X400X80_HS-21N]
U23  ADS1115  [R-PQFP-N10]

### Blocks framed on the sheet
BYPASS CHARGER: JP7

### Sub-sheets
U_I2C_ISO = I2C_ISO.SchDoc: SDA1 (bidir), SCL1 (in), SDA2 (bidir), SCL2 (out)

### Ports
SCL (in, see MAIN[3C]), SDA (bidir, see MAIN[3C])

### Nets
+5: C133.2 R79.2 R80.2 R88.2 U23.1(VCC)
+5_DRV: C116.1 D7.1(A) U22.17(INT_VDD)
+V_STANDBY: C113.1 C114.1 DZ1.2(K) JP7.2 Q13.1,2,3(S) Q14.5,6,7,8,9(D) R30.2 R181.2 R182.2
CHAR+: C112.1 J10.1 JP7.1 Q12.5(D) R81.2 R183.1 R185.2 R187.1 U22.4(DCIN)
GND: C112.2 C113.2 C114.2 C116.2 C118.2 C119.2 C120.2 C121.2 C133.1 C134.2 J10.2 J11.2 Q15.1,2,3(S) Q17.3(S) R83.2 R89.1 R194.1 R195.1 U22.21(GND) U23.2(GND) U23.5(ADDR)
VBAT: C120.1 C121.1 J11.1 JP9.2 Q13.5(D) Q16.3(S) R86.2 R186.2 R191.2 U22.11(BAT)
AC_DET: D9.1(A) R79.1 U23.8(A1)
ACP: D9.2(K) LED2.2 U22.5(ACP#)
CHAR_DET: D10.1(A) R80.1 U23.9(A2)
CHAR_SCL: port SCL, sheet U_I2C_ISO/SCL1
CHAR_SDA: port SDA, sheet U_I2C_ISO/SDA1
CHR: D10.2(K) LED3.2 U22.7(CHRG#)
NetC115_1: C115.1 R182.1 U22.1(CLN)
NetC115_2: C115.2 Q12.1,2,3(S) R30.1 R181.1 U22.2(CLP)
NetC117_1: C117.1 L5.1 Q14.1,2,3(S) Q15.5,6,7,8,9(D) U22.18(SW)
NetC117_2: C117.2 D7.2(K) U22.20(BOOST)
NetC118_1: C118.1 R188.1
NetC119_1: C119.1 R194.2 U22.13(PROG)
NetC134_1: C134.1 R82.1 R83.1 U23.7(A0)
NetDZ1_1: DZ1.1(A) Q13.4(G) R183.2
NetJP9_1: JP9.1 Q16.2(D) R82.2
NetL5_2: L5.2 R186.1 R189.2
NetLED2_1: LED2.1 R185.1
NetLED3_1: LED3.1 R81.1
NetQ12_4: Q12.4(G) U22.3(INFET)
NetQ14_4: Q14.4(G) U22.19(TGATE)
NetQ15_4: Q15.4(G) U22.16(BGATE)
NetQ16_1: Q16.1(G) R86.1 R87.2
NetQ17_1: Q17.1(G) R88.1 R89.2
NetQ17_2: Q17.2(D) R87.1
NetR175_2: U23.4(SDA) ; sheet U_I2C_ISO/SDA2
NetR176_2: U23.3(SCL) ; sheet U_I2C_ISO/SCL2
NetR187_2: R187.2 U22.6(SHDN#)
NetR188_2: R188.2 U22.12(ITH)
NetR189_1: R189.1 U22.15(CSP)
NetR190_1: R190.1 R195.2 U22.9(VFB)
NetR190_2: R190.2 U22.10(FBDIV)
NetR191_1: R191.1 U22.14(CSN)

Not connected (* = marked no-connect by the designer): U22 8(ICL#)*; U23 6(ALERT) 10(A3)

### Notes on the sheet
- Detect Charging and Adaptor_Plugin by sample voltage on channel A1 and A2, instead by optocouple

### Library data of the parts
C112 C114 C116 C121 = CN: 0603W106M250XD; PN: 0603W106M250XD
C113 C115 C117 C118 C120 C133 C134 = CN: CL10B104KA8NNNC; PN: CL10B104KA8NNNC
C119 = CN: C0603C472K4RECAUTO; PN: C0603C472K4RECAUTO
D7 D9 D10 = Diode SMD: 1N4148WX-TP; Code - JEDEC: DO-214-AB; Published: 8-Jun-2000; Revision: July-2002: Re-released for DXP Platform.; Publisher: Altium Limited; PN: 1N4148WX-TP
DZ1 = DIODE Zener: PN: DDZ9699T
J10 J11 = KF2: as J1 on sheet INPUT_PROTECTION; PN: S2P-VH; ComponentLink1URL: http://www.we-online.com; ComponentLink2URL: http://katalog.we-online.de/em/datasheet/6911031100xx.pdf
L5 = L-SMD-1: SRP1038A-8R2M; Manufacturer: Wurth Elektronik; PN: SRP1038A-8R2M; Inductance: 8.2 μH; ComponentLink1Description: Manufacturer; ComponentLink1URL: http://www.we-online.de; Created by: Baojun Chen; Created Date: Nov.2015; ComponentLink2Description: Datasheet; ComponentLink2URL: http://katalog.we-online.de/pbs/datasheet/78477010.pdf
LED2 LED3 = LED SMD: Value: LED 3 - 5 ly 2 Colour
Q12 Q13 = AONS21303C: 2.8mΩ 185A 30V P-Channel MOSFET; PN: AONS21303C
Q14 Q15 = AON7292: PN: AON7418
Q16 = AO3401: P-MOS 30V 4A
Q17 = AO3400: N-MOS 30V 5.8A
R30 R181 R186 = Res-SMD: VMK-R025-1.0-U; Manufacturer: Generic Components; Class: Passive; PN: VMK-R025-1.0-U; Publisher: Altium Hobart Technology Centre
R79-R82 R86-R89 R185 R195 = Res-SMD: as R206 on sheet MAIN; PN: ERJ-3EKF1002V; Publisher: Altium Hobart Technology Centre
R83 R189 R191 = Res-SMD: as R58 on sheet ANALOG; PN: ERA-3AEB302V; Publisher: Altium Hobart Technology Centre
R182 = Res-SMD: as R62 on sheet OVP; PN: ERJ-3EKF5101V; Publisher: Altium Hobart Technology Centre
R183 R187 R190 = Res-SMD: RC0603FR-07110KL; Manufacturer: Generic Components; Class: Passive; PN: RC0603FR-07110KL; Publisher: Altium Hobart Technology Centre
R188 = Res-SMD: RC0603FR-076K04L; Manufacturer: Generic Components; Class: Passive; PN: RC0603FR-076K04L; Publisher: Altium Hobart Technology Centre
R194 = Res-SMD: RMCF0603FT26K7; Manufacturer: Generic Components; Class: Passive; PN: RMCF0603FT26K7; Publisher: Altium Hobart Technology Centre
U22 = LTC4012: High Efficiency, Multi-Chemistry Battery Charger with PowerPath Control; PN: LTC4012IUF#PBF
U23 = ADS1115: ADS1115IRUGR; pin to pad: 1>8 2>3 3>10 4>9 5>1 6>2 7>4 8>5 9>6 10>7; PN: ADS1115IRUGR

## Sheet I2C_ISO.SchDoc
size A; SheetNumber: 19; SheetTotal: 21
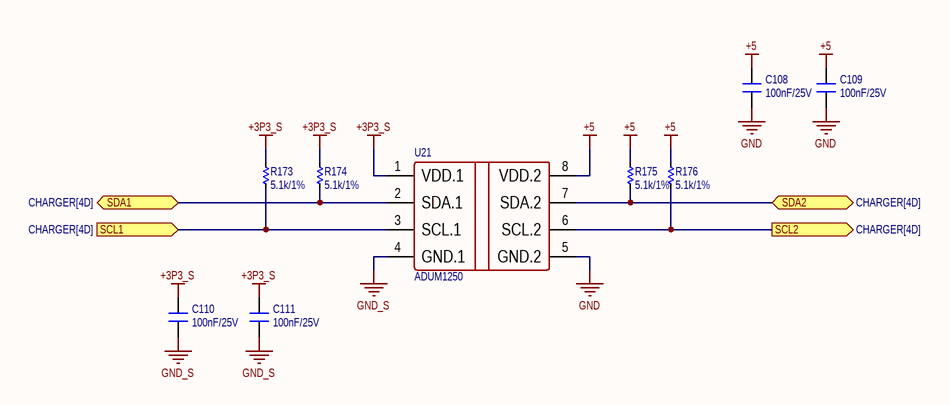
[diagram p19: I2C_ISO.SchDoc]

### Parts
C108  100nF/25V  [CN-SMD-0603]
C109  100nF/25V  [CN-SMD-0603]
C110  100nF/25V  [CN-SMD-0603]
C111  100nF/25V  [CN-SMD-0603]
R173  5.1k/1%  [RES-SMD-0603]
R174  5.1k/1%  [RES-SMD-0603]
R175  5.1k/1%  [RES-SMD-0603]
R176  5.1k/1%  [RES-SMD-0603]
U21  ADUM1250  [SO8]

### Ports
SCL1 (in, see CHARGER[4D]), SCL2 (out, see CHARGER[4D]), SDA1 (bidir, see CHARGER[4D]), SDA2 (bidir, see CHARGER[4D])

### Nets
+3P3_S: C110.1 C111.1 R173.1 R174.1 U21.1(VDD.1)
+5: C108.1 C109.1 R175.1 R176.1 U21.8(VDD.2)
GND: C108.2 C109.2 U21.5(GND.2)
GND_S: C110.2 C111.2 U21.4(GND.1)
CHAR_SCL: R173.2 U21.3(SCL.1) ; port SCL1
CHAR_SDA: R174.2 U21.2(SDA.1) ; port SDA1
NetR175_2: R175.2 U21.7(SDA.2) ; port SDA2
NetR176_2: R176.2 U21.6(SCL.2) ; port SCL2

### Library data of the parts
C108-C111 = CN: CL10B104KA8NNNC; PN: CL10B104KA8NNNC
R173-R176 = Res-SMD: as R62 on sheet OVP; PN: ERJ-3EKF5101V; Publisher: Altium Hobart Technology Centre
U21 = ADUM1250: Hot Swappable, Dual I2C Isolators; PN: ADUM1250ARZ-RL7